# EAGLE design Joulev2_RealTime (EAGLE 8.2.0)

## Sheet 1 of 3
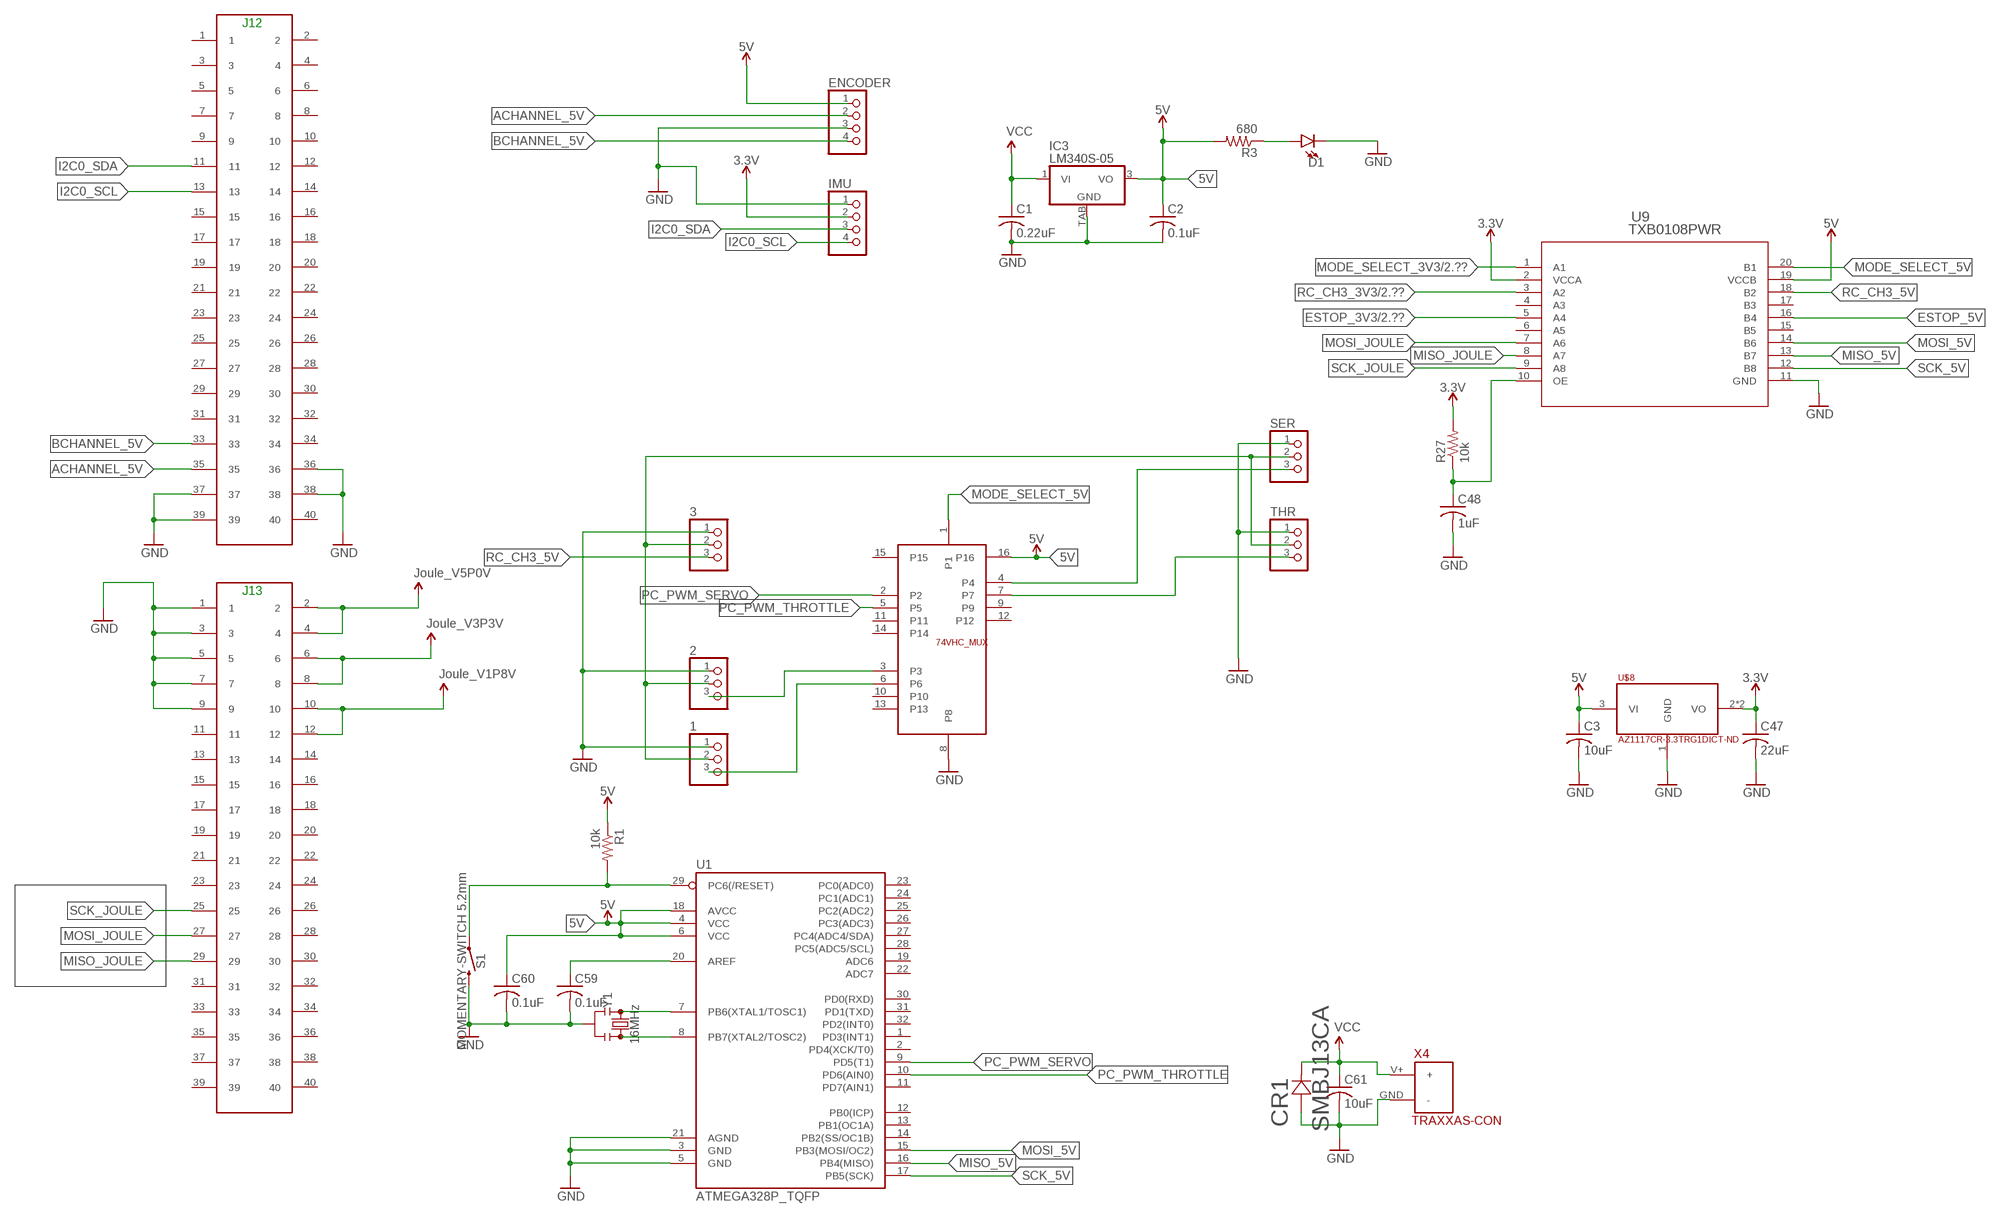
[diagram p0: schematic, sheet 1]

### Parts
1  PINHD-1X3  [1X03]
2  PINHD-1X3  [1X03]
3  PINHD-1X3  [1X03]
C1  0.22uF  C-USC0603  [C0603]
C2  0.1uF  C-USC0603  [C0603]
C3  10uF  C-USC0603  [C0603]
C47  22uF  C-USC0603  [C0603]
C48  1uF  C-USC0603  [C0603]
C59  0.1uF  C-USC0603  [C0603]
C60  0.1uF  C-USC0603  [C0603]
C61  10uF  C-USC0603  [C0603]
CR1  SMBJ13CA  [SMB]
D1  LED0603  [LED-0603]
ENCODER  PINHD-1X4  [1X04]
IC3  LM340S-05  [TO263-3]
IMU  PINHD-1X4  [1X04]
R1  10k  R-US_R0603  [R0603]
R3  680  R-US_R0603  [R0603]
R27  10k  R-US_R0603  [R0603]
S1  MOMENTARY-SWITCH 5.2mm  MOMENTARY-SWITCH-SPST-SMD-5.2MM  [TACTILE_SWITCH_SMD_5.2MM]
SER  PINHD-1X3  [1X03]
THR  PINHD-1X3  [1X03]
U1  ATMEGA328P_TQFP  [TQFP32-08]
U2  74VHC_MUXSO16  [SO16]
U9  TXB0108PWR  [PW20]
U$8  AZ1117CR-3.3TRG1DICT-ND  [SOT89R_INFINEON]
X1  J12HEADER_(JOULE)  [2X20]
X2  J13HEADER_(JOULE)  [2X20]
X4  TRAXXAS-CON  [TRAXXAS-CON]
Y1  16MHz  RESONATOR-16MHZSMD_3.2X1.3  [RESONATOR-SMD-3.2X1.3]

### Nets
3.3V: C47.1 IMU.2 R27.2 U9.2(VCCA) U$8.2(VO) U$8.4(VO) ; also sheet 2,3
5V: 1.2 2.2 3.2 C2.1 C3.1 C60.1 ENCODER.1 IC3.3(VO) R1.1 R3.2 SER.2 THR.2 U1.4(VCC) U1.6(VCC) U1.18(AVCC) U2.16 U9.19(VCCB) U$8.3(VI) ; also sheet 2,3
ACHANNEL_5V: ENCODER.2 X1.35
BCHANNEL_5V: ENCODER.4 X1.33
ESTOP_3V3: U9.5(A4) ; also sheet 2
ESTOP_5V: U9.16(B4) ; also sheet 2
GND: 1.1 2.1 3.1 C1.2 C2.2 C3.2 C47.2 C48.2 C59.2 C60.2 C61.2 CR1.2 D1.C ENCODER.3 IC3.TAB(GND) IMU.1 S1.3 SER.1 THR.1 U1.3(GND) U1.5(GND) U1.21(AGND) U2.8 U9.11(GND) U$8.1(GND) X1.36 X1.37 X1.38 X1.39 X2.1 X2.3 X2.5 X2.7 X2.9 X4.GND(-) Y1.2 ; also sheet 2,3
I2C0_SCL: IMU.4 X1.13
I2C0_SDA: IMU.3 X1.11
MISO_5V: U1.16(PB4(MISO)) U9.13(B7)
MISO_JOULE: U9.8(A7) X2.29
MODE_SELECT_3V3: U9.1(A1) ; also sheet 2
MODE_SELECT_5V: U2.1 U9.20(B1)
MOSI_5V: U1.15(PB3(MOSI/OC2)) U9.14(B6)
MOSI_JOULE: U9.7(A6) X2.27
N$2: SER.3 U2.4
N$3: THR.3 U2.7
N$4: R1.2 S1.1 U1.29(PC6(/RESET))
N$6: U1.7(PB6(XTAL1/TOSC1)) Y1.1
N$8: U1.8(PB7(XTAL2/TOSC2)) Y1.3
N$10: 2.3 U2.3
N$11: 1.3 U2.6
N$13: C59.1 U1.20(AREF)
N$20: D1.A R3.1
N$41: C48.1 R27.1 U9.10(OE)
PC_PWM_SERVO: U1.9(PD5(T1)) U2.2
PC_PWM_THROTTLE: U1.10(PD6(AIN0)) U2.5
RC_CH3_3V3: U9.3(A2) ; also sheet 2
RC_CH3_5V: 3.3 U9.18(B2)
SCK_5V: U1.17(PB5(SCK)) U9.12(B8)
SCK_JOULE: U9.9(A8) X2.25
V1P8V: X2.10 X2.12 ; supply symbol labelled Joule_V1P8V
V3P3V: X2.6 X2.8 ; supply symbol labelled Joule_V3P3V
V5P0V: X2.2 X2.4 ; supply symbol labelled Joule_V5P0V
VCC: C1.1 C61.1 CR1.1 IC3.1(VI) X4.V+(+) ; also sheet 2
Unconnected: U1.1(PD3(INT1)) U1.2(PD4(XCK/T0)) U1.11(PD7(AIN1)) U1.12(PB0(ICP)) U1.13(PB1(OC1A)) U1.14(PB2(SS/OC1B)) U1.19(ADC6) U1.22(ADC7) U1.23(PC0(ADC0)) U1.24(PC1(ADC1)) U1.25(PC2(ADC2)) U1.26(PC3(ADC3)) U1.27(PC4(ADC4/SDA)) U1.28(PC5(ADC5/SCL)) U1.30(PD0(RXD)) U1.31(PD1(TXD)) U1.32(PD2(INT0)) U2.9 U2.10 U2.11 U2.12 U2.13 U2.14 U2.15 U9.4(A3) U9.6(A5) U9.15(B5) U9.17(B3) X1.1 X1.2 X1.3 X1.4 X1.5 X1.6 X1.7 X1.8 X1.9 X1.10 X1.12 X1.14 X1.15 X1.16 X1.17 X1.18 X1.19 X1.20 X1.21 X1.22 X1.23 X1.24 X1.25 X1.26 X1.27 X1.28 X1.29 X1.30 X1.31 X1.32 X1.34 X1.40 X2.11 X2.13 X2.14 X2.15 X2.16 X2.17 X2.18 X2.19 X2.20 X2.21 X2.22 X2.23 X2.24 X2.26 X2.28 X2.30 X2.31 X2.32 X2.33 X2.34 X2.35 X2.36 X2.37 X2.38 X2.39 X2.40

### Notes on the sheet
- J12
- J13

## Sheet 2 of 3: E-stop
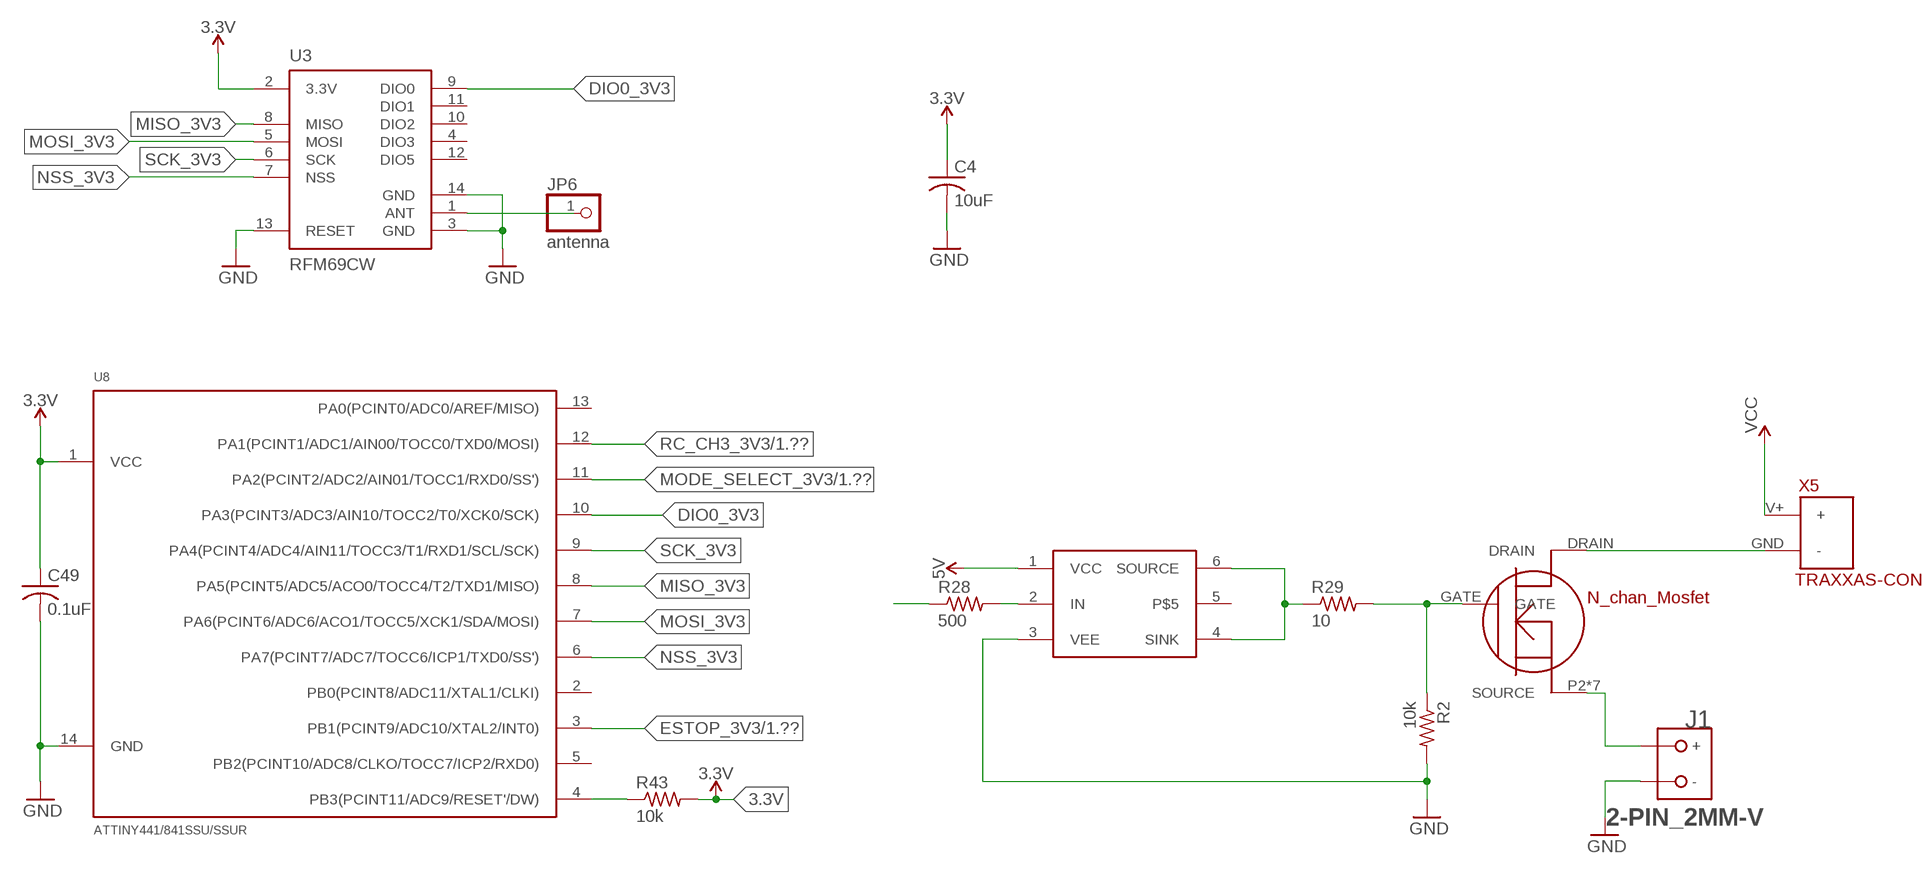
[diagram p1: schematic, sheet 2]

### Parts
C4  10uF  C-USC0603  [C0603]
C49  0.1uF  C-USC0603  [C0603]
J1  2-PIN_2MM-V  [2MM-2-V]
JP6  antenna  PINHD-1X1  [1X01]
Q1  N_CH_MOSFET_FDLBL260N100  [MO-299A]
R2  10k  R-US_R0603  [R0603]
R28  500  R-US_R0603  [R0603]
R29  10  R-US_R0603  [R0603]
R43  10k  R-US_R0603  [R0603]
U3  RFM69CW  [RFM69CW-XXXS2]
U8  ATTINY441/841SSU/SSUR  [SOIC-14]
U10  ZXGD3009DY  [SOT363]
X5  TRAXXAS-CON  [TRAXXAS-CON]

### Nets
3.3V: C4.1 C49.1 R43.2 U3.2(3.3V) U8.1(VCC) ; also sheet 1,3
5V: U10.1(VCC) ; also sheet 1,3
DIO0_3V3: U3.9(DIO0) U8.10(PA3(PCINT3/ADC3/AIN10/TOCC2/T0/XCK0/SCK))
ESTOP_3V3: U8.3(PB1(PCINT9/ADC10/XTAL2/INT0)) ; also sheet 1
ESTOP_5V: R28.1 ; also sheet 1
GND: C4.2 C49.2 J1.2(-) R2.2 U3.3(GND) U3.13(RESET) U3.14(GND) U8.14(GND) U10.3(VEE) ; also sheet 1,3
MISO_3V3: U3.8(MISO) U8.8(PA5(PCINT5/ADC5/ACO0/TOCC4/T2/TXD1/MISO))
MODE_SELECT_3V3: U8.11(PA2(PCINT2/ADC2/AIN01/TOCC1/RXD0/SS')) ; also sheet 1
MOSI_3V3: U3.5(MOSI) U8.7(PA6(PCINT6/ADC6/ACO1/TOCC5/XCK1/SDA/MOSI))
N$1: JP6.1 U3.1(ANT)
N$5: Q1.DRAIN X5.GND(-)
N$7: R28.2 U10.2(IN)
N$12: R43.1 U8.4(PB3(PCINT11/ADC9/RESET'/DW))
N$42: R29.1 U10.4(SINK) U10.6(SOURCE)
N$43: J1.1(+) Q1.P2(SOURCE) Q1.P3(SOURCE) Q1.P4(SOURCE) Q1.P5(SOURCE) Q1.P6(SOURCE) Q1.P7(SOURCE) Q1.P8(SOURCE)
N$45: Q1.GATE R2.1 R29.2
NSS_3V3: U3.7(NSS) U8.6(PA7(PCINT7/ADC7/TOCC6/ICP1/TXD0/SS'))
RC_CH3_3V3: U8.12(PA1(PCINT1/ADC1/AIN00/TOCC0/TXD0/MOSI)) ; also sheet 1
SCK_3V3: U3.6(SCK) U8.9(PA4(PCINT4/ADC4/AIN11/TOCC3/T1/RXD1/SCL/SCK))
VCC: X5.V+(+) ; also sheet 1
Unconnected: U3.4(DIO3) U3.10(DIO2) U3.11(DIO1) U3.12(DIO5) U8.2(PB0(PCINT8/ADC11/XTAL1/CLKI)) U8.5(PB2(PCINT10/ADC8/CLKO/TOCC7/ICP2/RXD0)) U8.13(PA0(PCINT0/ADC0/AREF/MISO)) U10.5

## Sheet 3 of 3: USB Hub
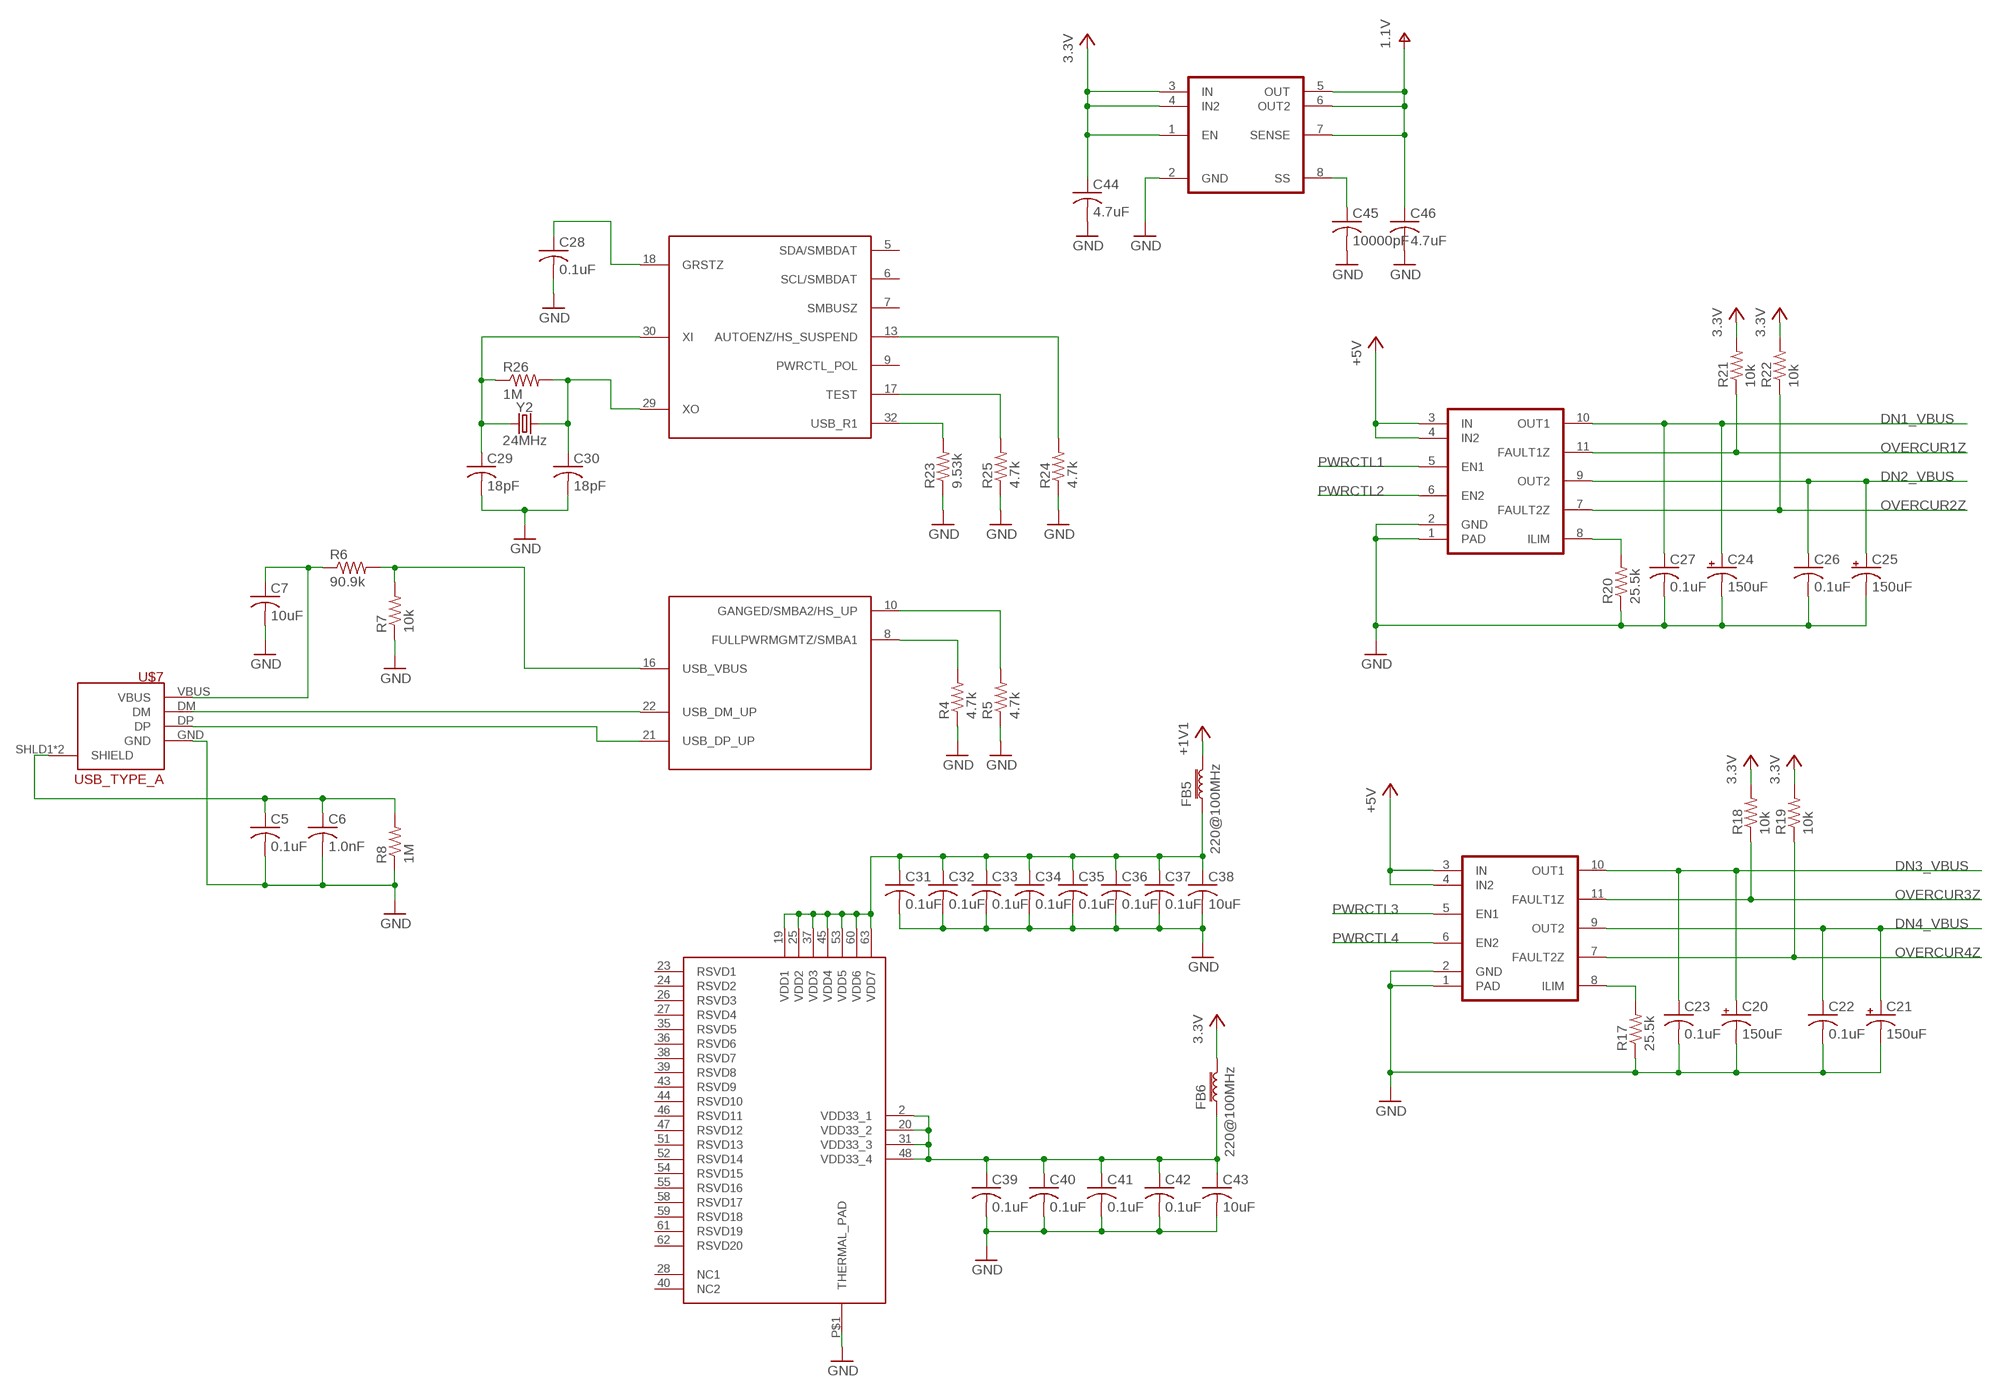
[diagram p2: schematic, sheet 3, part 1 of 2]
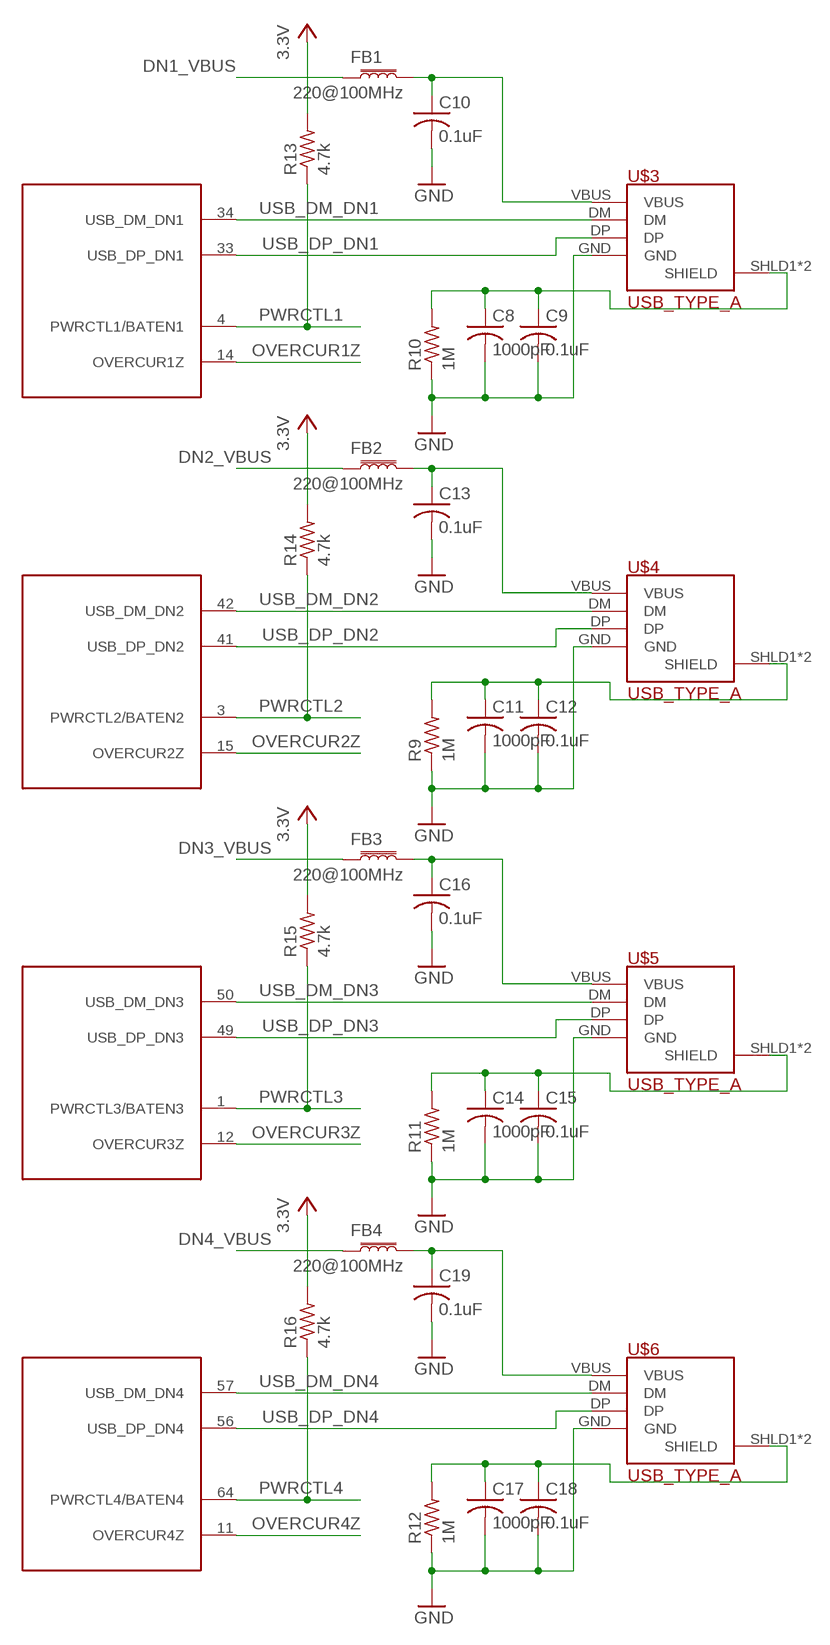
[diagram p3: schematic, sheet 3, part 2 of 2]

### Parts
C5  0.1uF  C-USC0603  [C0603]
C6  1.0nF  C-USC0603  [C0603]
C7  10uF  C-USC0603  [C0603]
C8  1000pF  C-USC0603  [C0603]
C9  0.1uF  C-USC0603  [C0603]
C10  0.1uF  C-USC0603  [C0603]
C11  1000pF  C-USC0603  [C0603]
C12  0.1uF  C-USC0603  [C0603]
C13  0.1uF  C-USC0603  [C0603]
C14  1000pF  C-USC0603  [C0603]
C15  0.1uF  C-USC0603  [C0603]
C16  0.1uF  C-USC0603  [C0603]
C17  1000pF  C-USC0603  [C0603]
C18  0.1uF  C-USC0603  [C0603]
C19  0.1uF  C-USC0603  [C0603]
C20  150uF  CPOL-USE3.5-8  [E3,5-8]
C21  150uF  CPOL-USE3.5-8  [E3,5-8]
C22  0.1uF  C-USC0603  [C0603]
C23  0.1uF  C-USC0603  [C0603]
C24  150uF  CPOL-USE3.5-8  [E3,5-8]
C25  150uF  CPOL-USE3.5-8  [E3,5-8]
C26  0.1uF  C-USC0603  [C0603]
C27  0.1uF  C-USC0603  [C0603]
C28  0.1uF  C-USC0603  [C0603]
C29  18pF  C-USC0603  [C0603]
C30  18pF  C-USC0603  [C0603]
C31  0.1uF  C-USC0603  [C0603]
C32  0.1uF  C-USC0603  [C0603]
C33  0.1uF  C-USC0603  [C0603]
C34  0.1uF  C-USC0603  [C0603]
C35  0.1uF  C-USC0603  [C0603]
C36  0.1uF  C-USC0603  [C0603]
C37  0.1uF  C-USC0603  [C0603]
C38  10uF  C-USC0603  [C0603]
C39  0.1uF  C-USC0603  [C0603]
C40  0.1uF  C-USC0603  [C0603]
C41  0.1uF  C-USC0603  [C0603]
C42  0.1uF  C-USC0603  [C0603]
C43  10uF  C-USC0603  [C0603]
C44  4.7uF  C-USC0603  [C0603]
C45  10000pF  C-USC0603  [C0603]
C46  4.7uF  C-USC0603  [C0603]
FB1  220@100MHz  FERRITE_BEAD-0603  [0603]
FB2  220@100MHz  FERRITE_BEAD-0603  [0603]
FB3  220@100MHz  FERRITE_BEAD-0603  [0603]
FB4  220@100MHz  FERRITE_BEAD-0603  [0603]
FB5  220@100MHz  FERRITE_BEAD-0603  [0603]
FB6  220@100MHz  FERRITE_BEAD-0603  [0603]
R4  4.7k  R-US_R0603  [R0603]
R5  4.7k  R-US_R0603  [R0603]
R6  90.9k  R-US_R0603  [R0603]
R7  10k  R-US_R0603  [R0603]
R8  1M  R-US_R0603  [R0603]
R9  1M  R-US_R0603  [R0603]
R10  1M  R-US_R0603  [R0603]
R11  1M  R-US_R0603  [R0603]
R12  1M  R-US_R0603  [R0603]
R13  4.7k  R-US_R0603  [R0603]
R14  4.7k  R-US_R0603  [R0603]
R15  4.7k  R-US_R0603  [R0603]
R16  4.7k  R-US_R0603  [R0603]
R17  25.5k  R-US_R0603  [R0603]
R18  10k  R-US_R0603  [R0603]
R19  10k  R-US_R0603  [R0603]
R20  25.5k  R-US_R0603  [R0603]
R21  10k  R-US_R0603  [R0603]
R22  10k  R-US_R0603  [R0603]
R23  9.53k  R-US_R0603  [R0603]
R24  4.7k  R-US_R0603  [R0603]
R25  4.7k  R-US_R0603  [R0603]
R26  1M  R-US_R0603  [R0603]
U4  ADP1706ARDZ-1.1-R7  [SOIC8]
U$1  TUSB4041  [TQFP64-10X10]
U$3  USB_TYPE_A  [USB_TYPE_A]
U$4  USB_TYPE_A  [USB_TYPE_A]
U$5  USB_TYPE_A  [USB_TYPE_A]
U$6  USB_TYPE_A  [USB_TYPE_A]
U$7  USB_TYPE_A  [USB_TYPE_A]
U$10  TPS2561DRCT  [10-VSON]
U$11  TPS2561DRCT  [10-VSON]
Y2  24MHz  CRYSTAL-24MHZ"  [CRYSTAL-SMD-5X3.2-4PAD]

### Nets
1.1V: C46.1 FB5.2 U4.5(OUT) U4.6(OUT2) U4.7(SENSE) ; supply symbol labelled +1V1
3.3V: C44.1 FB6.2 R13.2 R14.2 R15.2 R16.2 R18.2 R19.2 R21.2 R22.2 U4.1(EN) U4.3(IN) U4.4(IN2) ; also sheet 1,2
5V: U$10.3(IN) U$10.4(IN2) U$11.3(IN) U$11.4(IN2) ; supply symbol labelled +5V ; also sheet 1,2
DN1_VBUS: C24.+ C27.1 FB1.1 U$11.10(OUT1)
DN2_VBUS: C25.+ C26.1 FB2.1 U$11.9(OUT2)
DN3_VBUS: C20.+ C23.1 FB3.1 U$10.10(OUT1)
DN4_VBUS: C21.+ C22.1 FB4.1 U$10.9(OUT2)
GND: C5.2 C6.2 C7.2 C8.2 C9.2 C10.2 C11.2 C12.2 C13.2 C14.2 C15.2 C16.2 C17.2 C18.2 C19.2 C20.- C21.- C22.2 C23.2 C24.- C25.- C26.2 C27.2 C28.2 C29.2 C30.2 C31.2 C32.2 C33.2 C34.2 C35.2 C36.2 C37.2 C38.2 C39.2 C40.2 C41.2 C42.2 C43.2 C44.2 C45.2 C46.2 R4.1 R5.1 R7.1 R8.1 R9.1 R10.1 R11.1 R12.1 R17.1 R20.1 R23.1 R24.1 R25.1 U4.2(GND) U$1.P$1(THERMAL_PAD) U$3.GND U$4.GND U$5.GND U$6.GND U$7.GND U$10.1(PAD) U$10.2(GND) U$11.1(PAD) U$11.2(GND) ; also sheet 1,2
N$9: R4.2 U$1.8(FULLPWRMGMTZ/SMBA1)
N$14: R5.2 U$1.10(GANGED/SMBA2/HS_UP)
N$15: R6.2 R7.2 U$1.16(USB_VBUS)
N$16: C7.1 R6.1 U$7.VBUS
N$17: C13.1 FB2.2 U$4.VBUS
N$18: C5.1 C6.1 R8.2 U$7.SHLD1(SHIELD) U$7.SHLD2(SHIELD)
N$19: U$1.22(USB_DM_UP) U$7.DM
N$21: U$1.21(USB_DP_UP) U$7.DP
N$22: C16.1 FB3.2 U$5.VBUS
N$23: C10.1 FB1.2 U$3.VBUS
N$24: C19.1 FB4.2 U$6.VBUS
N$25: R20.2 U$11.8(ILIM)
N$26: C28.1 U$1.18(GRSTZ)
N$27: R23.2 U$1.32(USB_R1)
N$28: R17.2 U$10.8(ILIM)
N$29: C29.1 R26.1 U$1.30(XI) Y2.1
N$30: C30.1 R26.2 U$1.29(XO) Y2.3
N$31: R25.2 U$1.17(TEST)
N$32: C39.1 C40.1 C41.1 C42.1 C43.1 FB6.1 U$1.2(VDD33_1) U$1.20(VDD33_2) U$1.31(VDD33_3) U$1.48(VDD33_4)
N$33: R24.2 U$1.13(AUTOENZ/HS_SUSPEND)
N$34: C31.1 C32.1 C33.1 C34.1 C35.1 C36.1 C37.1 C38.1 FB5.1 U$1.19(VDD1) U$1.25(VDD2) U$1.37(VDD3) U$1.45(VDD4) U$1.53(VDD5) U$1.60(VDD6) U$1.63(VDD7)
N$35: C17.1 C18.1 R12.2 U$6.SHLD1(SHIELD) U$6.SHLD2(SHIELD)
N$36: C14.1 C15.1 R11.2 U$5.SHLD1(SHIELD) U$5.SHLD2(SHIELD)
N$37: C8.1 C9.1 R10.2 U$3.SHLD1(SHIELD) U$3.SHLD2(SHIELD)
N$38: C11.1 C12.1 R9.2 U$4.SHLD1(SHIELD) U$4.SHLD2(SHIELD)
N$40: C45.1 U4.8(SS)
OVERCUR1Z: R21.1 U$1.14(OVERCUR1Z) U$11.11(FAULT1Z)
OVERCUR2Z: R22.1 U$1.15(OVERCUR2Z) U$11.7(FAULT2Z)
OVERCUR3Z: R18.1 U$1.12(OVERCUR3Z) U$10.11(FAULT1Z)
OVERCUR4Z: R19.1 U$1.11(OVERCUR4Z) U$10.7(FAULT2Z)
PWRCTL1: R13.1 U$1.4(PWRCTL1/BATEN1) U$11.5(EN1)
PWRCTL2: R14.1 U$1.3(PWRCTL2/BATEN2) U$11.6(EN2)
PWRCTL3: R15.1 U$1.1(PWRCTL3/BATEN3) U$10.5(EN1)
PWRCTL4: R16.1 U$1.64(PWRCTL4/BATEN4) U$10.6(EN2)
USB_DM_DN1: U$1.34(USB_DM_DN1) U$3.DM
USB_DM_DN2: U$1.42(USB_DM_DN2) U$4.DM
USB_DM_DN3: U$1.50(USB_DM_DN3) U$5.DM
USB_DM_DN4: U$1.57(USB_DM_DN4) U$6.DM
USB_DP_DN1: U$1.33(USB_DP_DN1) U$3.DP
USB_DP_DN2: U$1.41(USB_DP_DN2) U$4.DP
USB_DP_DN3: U$1.49(USB_DP_DN3) U$5.DP
USB_DP_DN4: U$1.56(USB_DP_DN4) U$6.DP
Unconnected: U$1.5(SDA/SMBDAT) U$1.6(SCL/SMBDAT) U$1.7(SMBUSZ) U$1.9(PWRCTL_POL) U$1.23(RSVD1) U$1.24(RSVD2) U$1.26(RSVD3) U$1.27(RSVD4) U$1.28(NC1) U$1.35(RSVD5) U$1.36(RSVD6) U$1.38(RSVD7) U$1.39(RSVD8) U$1.40(NC2) U$1.43(RSVD9) U$1.44(RSVD10) U$1.46(RSVD11) U$1.47(RSVD12) U$1.51(RSVD13) U$1.52(RSVD14) U$1.54(RSVD15) U$1.55(RSVD16) U$1.58(RSVD17) U$1.59(RSVD18) U$1.61(RSVD19) U$1.62(RSVD20)

## Library data of the parts
1-3 SER THR = adafruit:PINHD-1X3: PIN HEADER
C1-C19 C22 C23 C26-C49 C59-C61 = rcl:C-US: CAPACITOR, American symbol
C20 C21 C24 C25 = rcl:CPOL-US: POLARIZED CAPACITOR, American symbol
CR1 = Roboracing:SMBJ13CA; MANUFACTURER_PART_NUMBER: SMBJ13CA; VENDOR: Bourns Electronics
D1 = SparkFun-LED:LED: LED (Generic) Standard schematic elements and footprints for 5mm, 3mm, 1206, and 0603 sized LEDs. Generic LEDs with no color specified.
ENCODER IMU = pinhead:PINHD-1X4: PIN HEADER
FB1-FB6 = SparkFun-Coils:FERRITE_BEAD: Ferrite Bead (blocks, cores, rings, chokes, etc.) Inductor with layers of ferrite used to suppress high frequencies. Often used to isolate high frequency noise. SparkFun Products: IOIO-OTG - V2.2 <https://www.sparkfun.com/products/13613> SparkFun SAMD21 Mini Breakout <https://www.sparkfun.com/products/13664> SparkFun 6 Degrees of Freedom Breakout - LSM6DS3 <https://www.sparkfun.com/products/13339> SparkFun SAMD21 Dev Breakout <https://www.sparkfun.com/products/13672>; PROD_ID: NDUC-07859; VALUE: 30Ω/1.8A
IC3 = linear:LM340?-*: Positive VOLTAGE REGULATOR Source: http://cache.national.com/ds/LM/LM340.pdf
J1 = RoboJackets-Connectors:2-PIN_2MM-*; PINS: 2; PIN_PITCH: 2.0 mm
JP6 = adafruit:PINHD-1X1: Pin header 1x1 for 0.1" spacing With round pins
Q1 = Roboracing:N_CH_MOSFET_FDLBL260N100
R1-R29 R43 = rcl:R-US_: RESISTOR, American symbol
S1 = Roboracing:MOMENTARY-SWITCH-SPST: Momentary Switch (Pushbutton) - SPST Normally-open (NO) SPST momentary switches (buttons, pushbuttons). Variants PTH-12MM - 12mm square, through-hole Momentary Pushbutton Switch - 12mm Square <https://www.sparkfun.com/products/9190> (COM-09190) PTH-6.0MM, PTH-6.0MM-KIT - 6.0mm square, through-hole Mini Pushbutton Switch <https://www.sparkfun.com/products/97> (COM-00097) KIT package intended for soldering kit's - only one side of pads' copper is exposed. PTH-RIGHT-ANGLE-KIT - Right-angle, through-hole Right Angle Tactile Button <https://www.sparkfun.com/products/10791> - Used on SparkFun BigTime Watch Kit <https://www.sparkfun.com/products/11734> SMD-12MM - 12mm square, surface-mount Tactile Button - SMD (12mm) <https://www.sparkfun.com/products/12993> (COM-12993) Used on SparkFun PicoBoard <https://www.sparkfun.com/products/11888> SMD-4.5MM - 4.5mm Square Trackball Switch Used on SparkFun Blackberry Trackballer Breakout <https://www.sparkfun.com/products/13169> SMD-4.6MMX2.8MM - 4.60mm x 2.80mm, surface mount Used on SparkFun SAMD21 Mini Breakout <https://www.sparkfun.com/products/13664> SMD-5.2MM, SMD-5.2-REDUNDANT - 5.2mm square, surface-mount Mini Pushbutton Switch - SMD <https://www.sparkfun.com/products/8720> (COM-08720) Used on Arduino Pro Mini <https://www.sparkfun.com/products/11114> REDUNDANT package connects both switch circuits together SMD-6.0X3.5MM - 6.0 x 3.5mm, surface mount Momentary Reset Switch SMD <https://www.sparkfun.com/products/8229> (COM-08229) SMD-6.2MM-TALL - 6.2mm square, surface mount Tactile Button - SMD (6mm) <https://www.sparkfun.com/products/12992> Used on SparkFun Digital Sandbox <https://www.sparkfun.com/products/12651> SMD-RIGHT-ANGLE - Right-angle, surface mount Used on SparkFun Block for Intel® Edison - Arduino <https://www.sparkfun.com/products/13036>; PROD_ID: SWCH-08247; SF_SKU: COM-08720
U1 = SparkFun-IC-Microcontroller:ATMEGA328P_TQFP: Popular 328P in QFP Storefront component: ATmega328 - TQFP <https://www.sparkfun.com/products/13448> (COM-13448) Datasheet <http://www.sparkfun.com/datasheets/Components/SMD/ATMega328.pdf> SparkFun Products SparkFun RedBoard - Programmed with Arduino <https://www.sparkfun.com/products/12757> (DEV-12757) Arduino Pro Mini 328 - 5V/16MHz <https://www.sparkfun.com/products/11113> (DEV-11113) Arduino Pro Mini 328 - 3.3V/8MHz <https://www.sparkfun.com/products/11114> (DEV-11114) SparkFun OpenLog <https://www.sparkfun.com/products/13712> (DEV-13712) SparkFun MicroView - OLED Arduino Module <https://www.sparkfun.com/products/12923> (DEV-12923) SparkFun Digital Sandbox <https://www.sparkfun.com/products/12651> (DEV-12651) SparkFun PicoBoard <https://www.sparkfun.com/products/11888> (WIG-11888) Arduino Fio <https://www.sparkfun.com/products/10116> (DEV-10116) LilyPad Arduino 328 Main Board <https://www.sparkfun.com/products/13342> (DEV-13342) SparkFun RedStick <https://www.sparkfun.com/products/13741> (DEV-13741) LilyPad MP3 <https://www.sparkfun.com/products/11013> (DEV-11013) LilyPad Arduino SimpleSnap <https://www.sparkfun.com/products/10941> (DEV-10941) SparkFun Stepoko <https://www.sparkfun.com/products/13899> (ROB-13899) SparkFun Geiger Counter <https://www.sparkfun.com/products/11345> (SEN-11345) SparkFun EL Sequencer <https://www.sparkfun.com/products/12781> (COM-12781) Arduino Pro 328 - 5V/16MHz <https://www.sparkfun.com/products/10915> (DEV-10915) CryptoCape <https://www.sparkfun.com/products/12773> (DEV-12773) SparkFun IR Thermometer Evaluation Board - MLX90614 <https://www.sparkfun.com/products/10740> (SEN-10740) SparkFun RedBot Mainboard <https://www.sparkfun.com/products/12097> (ROB-12097) Arduino Pro 328 - 3.3V/8MHz <https://www.sparkfun.com/products/10914> (DEV-10914) SparkFun Block for Intel® Edison - Arduino <https://www.sparkfun.com/products/13036> (DEV-13036) SparkFun Simon Says - Surface Mount Soldering Kit <https://www.sparkfun.com/products/10935> (KIT-10935) SparkFun 7-Segment Serial Display - Red <https://www.sparkfun.com/products/11441> (COM-11441) SparkFun 7-Segment Serial Display - White <https://www.sparkfun.com/products/11629> (COM-11629) SparkFun 7-Segment Serial Display - Yellow <https://www.sparkfun.com/products/11443> (COM-11443) SparkFun 7-Segment Serial Display - Kelly Green <https://www.sparkfun.com/products/11440> (COM-11440) SparkFun 7-Segment Serial Display - Blue <https://www.sparkfun.com/products/11442> (COM-11442) SparkFun OpenSegment Serial Display - 20mm (Blue) <https://www.sparkfun.com/products/11647> (COM-11647) SparkFun OpenSegment Serial Display - 20mm (Green) <https://www.sparkfun.com/products/11646> (COM-11646) SparkFun OpenSegment Serial Display - 20mm (White) <https://www.sparkfun.com/products/11648> (COM-11648) SparkFun OpenSegment Serial Display - 20mm (Red) <https://www.sparkfun.com/products/11644> (COM-11644) SparkFun OpenSegment Serial Display - 20mm (Yellow) <https://www.sparkfun.com/products/11645> (COM-11645) SparkFun OpenSegment Shield <https://www.sparkfun.com/products/13190> (DEV-13190); PROD_ID: IC-09069
U2 = Roboracing:74VHC_MUX
U3 = mike-temp:RFM69
U4 = Roboracing:ADP1706ARDZ-1.1-R7
U8 = rgb-led:ATTINY441/841
U9 = Roboracing:TXB0108PWR; MANUFACTURER_PART_NUMBER: TXB0108PWR; VENDOR: Texas Instruments
U10 = Roboracing:ZXGD3009DY
U$1 = Roboracing:TUSB4041
U$3-U$7 = Roboracing:USB_TYPE_A
U$8 = Roboracing:AZ1117CR-3.3TRG1DICT-ND
U$10 U$11 = Roboracing:TPS2561DRCT
X1 = Roboracing:J12HEADER_(JOULE)
X2 = Roboracing:J13HEADER_(JOULE)
X4 X5 = Roboracing:TRAXXAS-CON
Y1 = SparkFun-Clocks:RESONATOR-16MHZ: 16MHz Resonator Digikey Example <http://www.digikey.com/product-detail/en/murata-electronics-north-america/CSTCE16M0V53-R0/490-1198-1-ND/584635> Frequency: 16MHz Frequency Stability: ±0.3% Frequency Tolerance: ±0.5% Capacitance: 15pF SparkFun Products SparkFun OpenLog <https://www.sparkfun.com/products/13712> SparkFun MicroView - OLED Arduino Module <https://www.sparkfun.com/products/12923>; PROD_ID: XTAL-08900
Y2 = SparkFun-Clocks:CRYSTAL-24MHZ: 24MHz Crystal Datasheet <http://www.sparkfun.com/datasheets/Components/AT-SMD-5x3.pdf> Frequency: 24MHz Frequency Tolerance: ±20ppm Load Capacitance: 12pF SparkFun Products: USB Bit Whacker <https://www.sparkfun.com/products/762>; PROD_ID: XTAL-08298; SF_ID: COM-08581

## Board
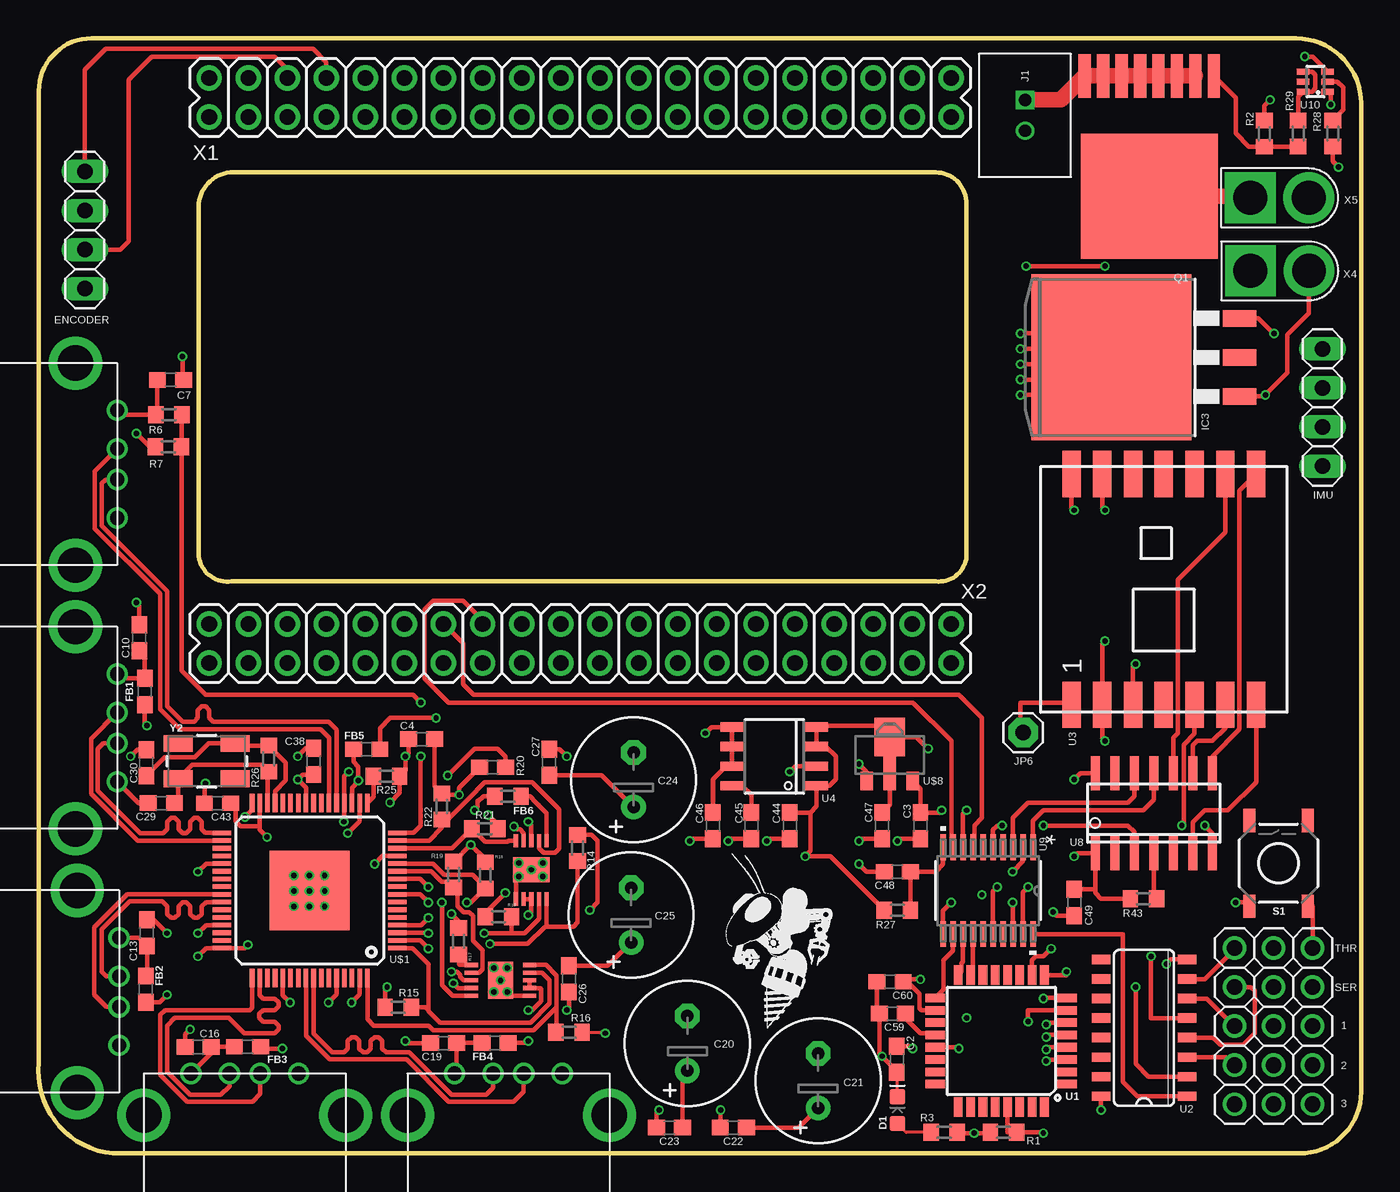
[diagram p4: board, top side]
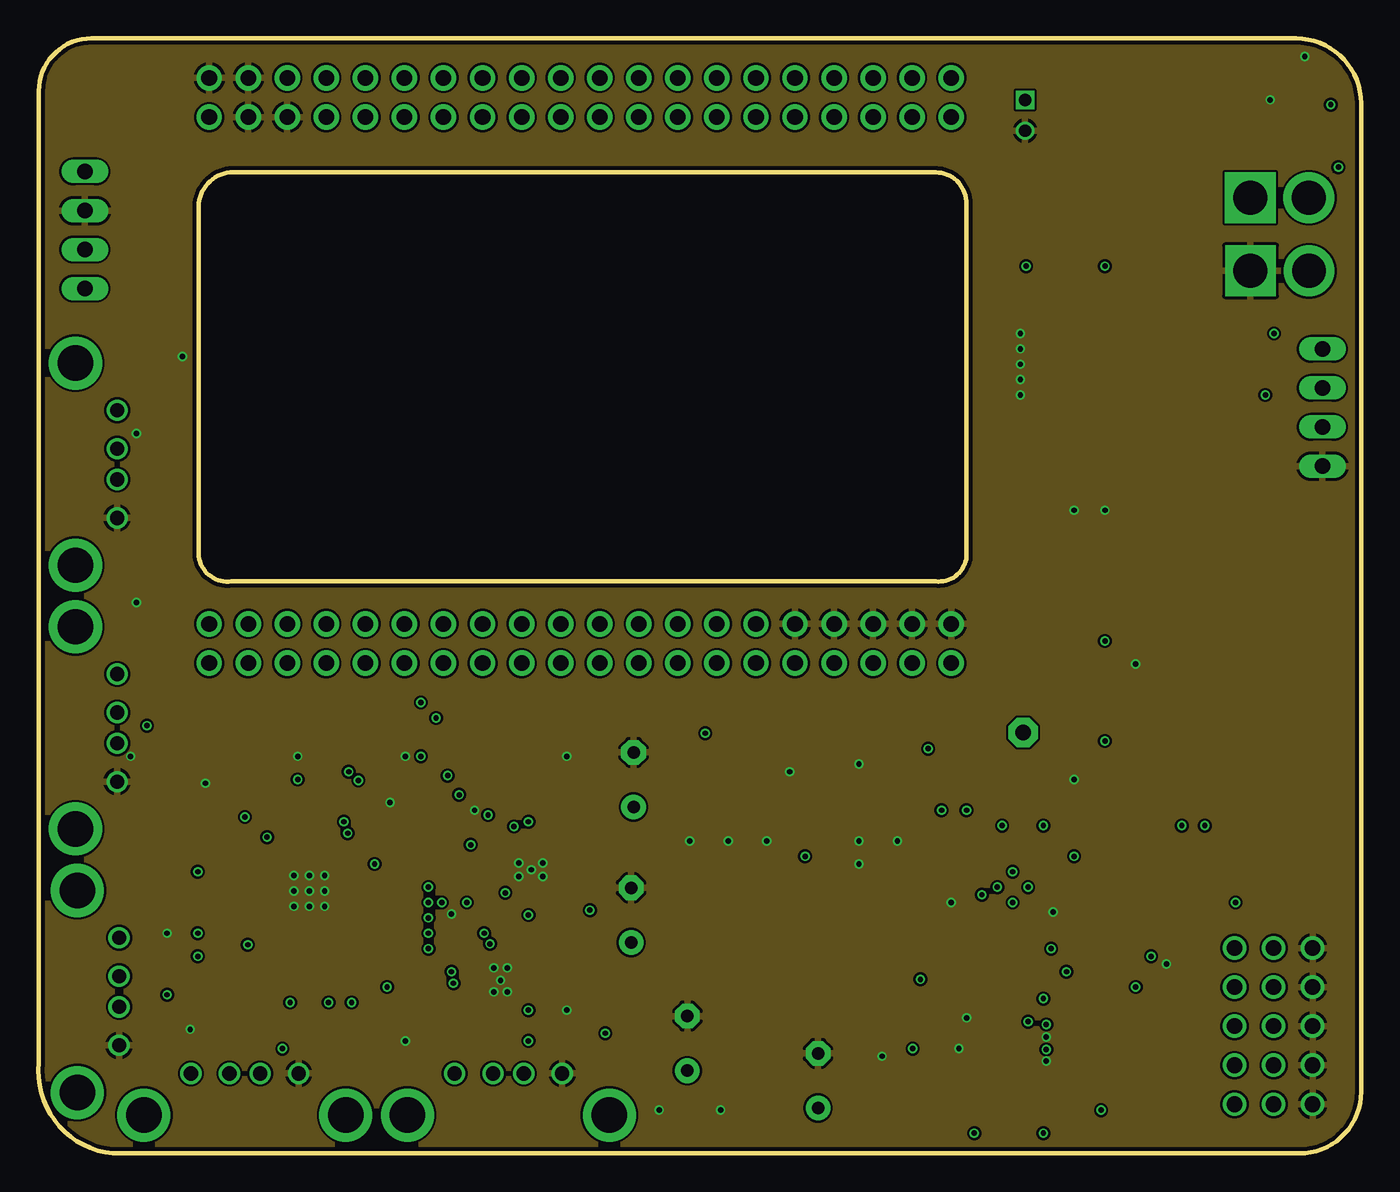
[diagram p5: board, inner layer Route2]
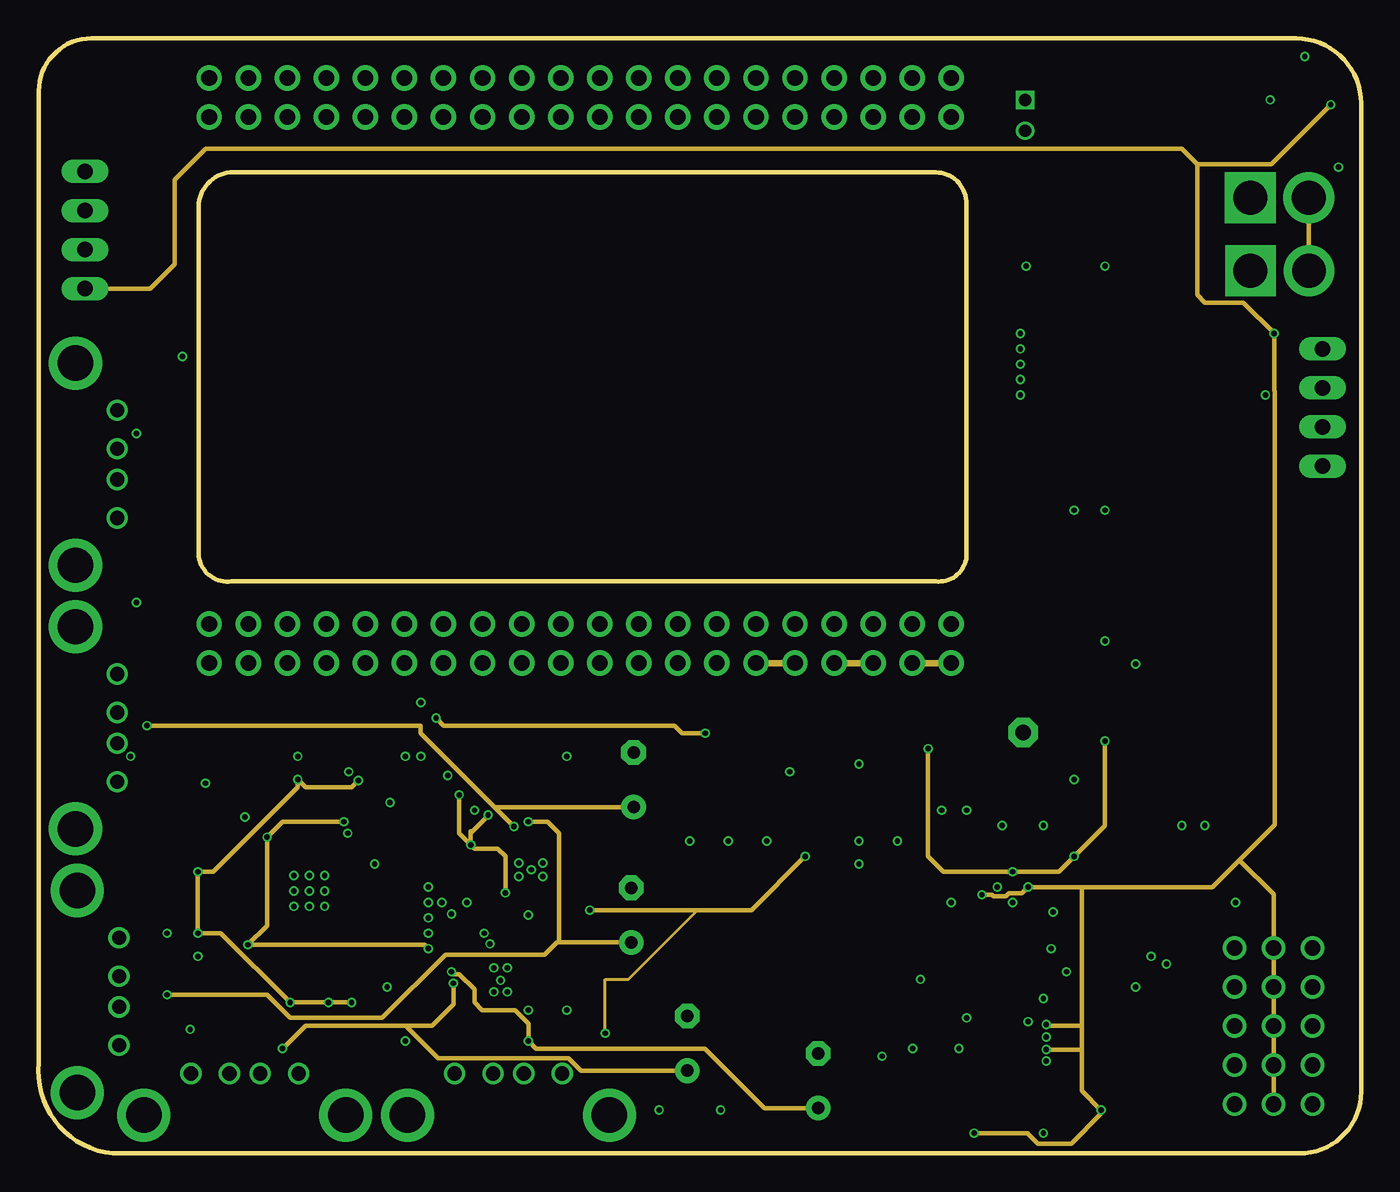
[diagram p6: board, inner layer Route3]
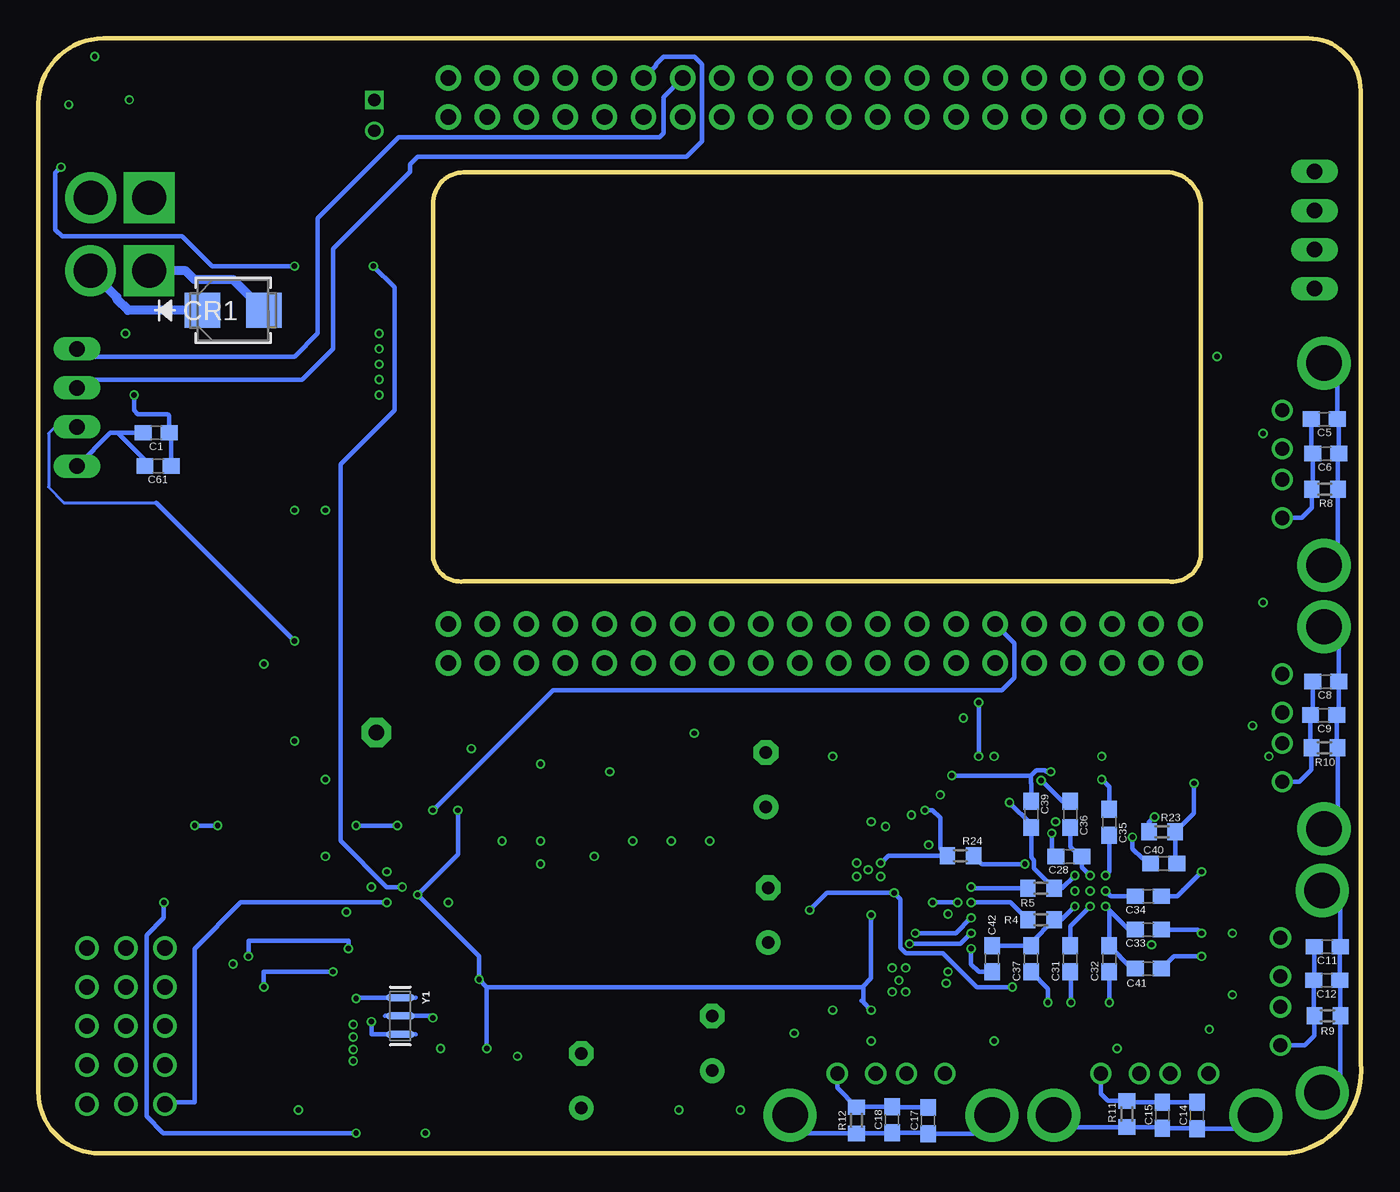
[diagram p7: board, bottom side, seen from below]

Size 86.03 x 72.5 mm. Coordinates in mm from the lower left corner, seen from the top.
Outline: 86.03,4 86.03,68.27 arc90 81.8,72.5 3.44,72.5 arc90 0.03,69.09 0.03,5.91 arc90 4.83,0 82.03,0 arc90 86.03,4
Outline: 58.37,63.79 12.67,63.79 arc90 10.43,61.55 10.43,38.82 arc90 12.54,37.2 58.37,37.2 arc90 60.37,38.82 60.37,61.73 arc90 58.37,63.79
Copper layers (1+2*3+16): Top 0.018mm / dielectric 0.36mm / Route2 0.035mm / dielectric 0.71mm / Route3 0.035mm / dielectric 0.36mm / Bottom 0.018mm
Design rules "eC_4Layer_PClass6_BaseCopperO18-I35_eCDefault *": minimum track width 0.15mm, minimum drill 0.35mm, track to track 0.15mm, track to pad 0.15mm, pad to pad 0.15mm, via to via 0.15mm, smd to smd 0mil, copper to edge 0.25mm, drill to drill 0.35mm, minimum pad ring 0.175mm, minimum via ring 0.125mm, stop-mask expansion 0mil, vias tented up to drill 0.45mm, thermal gap 0.2mm

### Footprints (pad centres in the part's own frame; a part is rotated, then mirrored left to right if it is on the bottom)
1X03 = drill 1.016: 1 -2.54,0; 2 0,0; 3 2.54,0
C0603 = smd 1.1 x 1: 1 -0.85,0; 2 0.85,0
E3,5-8 = drill 0.813 pad 1.6: + -1.778,0 | drill 0.813 pad 1.6 octagon: - 1.778,0
SMB = smd 2.311 x 2.261: 1 -1.994,0; 2 1.994,0
LED-0603 = smd 1 x 1: A -0.877,0; C 0.877,0
1X04 = drill 1.016 long: 1 -3.81,0; 2 -1.27,0; 3 1.27,0; 4 3.81,0
0603 = smd 1.1 x 1: 1 -0.85,0; 2 0.85,0
TO263-3 = smd 1.067 x 2.159: 1 -2.54,-5.791; 2 0,-5.791; 3 2.54,-5.791 | smd 10.8 x 10.41: TAB 0,2.54
2MM-2-V = drill 0.8 square: 1 0,0 | drill 0.8: 2 2,0
1X01 = drill 1.016 pad 1.93 octagon: 1 0,0
MO-299A = smd 8.9 x 8.1: DRAIN 0,2.58 | smd 0.8 x 2.8: GATE -4.2,-5.24; P2 -3,-5.24; P3 -1.8,-5.24; P4 -0.6,-5.24; P5 0.6,-5.24; P6 1.8,-5.24; P7 3,-5.24; P8 4.2,-5.24
R0603 = smd 1 x 1.1: 1 -0.85,0; 2 0.85,0
TACTILE_SWITCH_SMD_5.2MM = smd 1.524 x 0.762: 1 -2.794,1.905; 2 2.794,1.905; 3 -2.794,-1.905; 4 2.794,-1.905
TQFP32-08 = smd 1.27 x 0.559: 1 -4.293,2.8; 2 -4.293,2; 3 -4.293,1.2; 4 -4.293,0.4; 5 -4.293,-0.4; 6 -4.293,-1.2; 7 -4.293,-2; 8 -4.293,-2.8; 17 4.293,-2.8; 18 4.293,-2; 19 4.293,-1.2; 20 4.293,-0.4; 21 4.293,0.4; 22 4.293,1.2; 23 4.293,2; 24 4.293,2.8 | smd 0.559 x 1.27: 9 -2.8,-4.293; 10 -2,-4.293; 11 -1.2,-4.293; 12 -0.4,-4.293; 13 0.4,-4.293; 14 1.2,-4.293; 15 2,-4.293; 16 2.8,-4.293; 25 2.8,4.293; 26 2,4.293; 27 1.2,4.293; 28 0.4,4.293; 29 -0.4,4.293; 30 -1.2,4.293; 31 -2,4.293; 32 -2.8,4.293
SO16 = smd 0.6 x 1.2: 1 -4.445,-2.8; 2 -3.175,-2.8; 3 -1.905,-2.8; 4 -0.635,-2.8; 5 0.635,-2.8; 6 1.905,-2.8; 7 3.175,-2.8; 8 4.445,-2.8; 9 4.445,2.8; 10 3.175,2.8; 11 1.905,2.8; 12 0.635,2.8; 13 -0.635,2.8; 14 -1.905,2.8; 15 -3.175,2.8; 16 -4.445,2.8
RFM69CW-XXXS2 = smd 3 x 1.2: 1 -7.5,6; 2 -7.5,4; 3 -7.5,2; 4 -7.5,0; 5 -7.5,-2; 6 -7.5,-4; 7 -7.5,-6; 8 7.5,-6; 9 7.5,-4; 10 7.5,-2; 11 7.5,0; 12 7.5,2; 13 7.5,4; 14 7.5,6
SOIC8 = smd 0.6 x 1.5: 1 -1.905,-2.75; 2 -0.635,-2.75; 3 0.635,-2.75; 4 1.905,-2.75; 5 1.905,2.75; 6 0.635,2.75; 7 -0.635,2.75; 8 -1.905,2.75
SOIC-14 = smd 0.6 x 2.2: 1 -3.81,-2.6; 2 -2.54,-2.6; 3 -1.27,-2.6; 4 0,-2.6; 5 1.27,-2.6; 6 2.54,-2.6; 7 3.81,-2.6; 8 3.81,2.6; 9 2.54,2.6; 10 1.27,2.6; 11 0,2.6; 12 -1.27,2.6; 13 -2.54,2.6; 14 -3.81,2.6
PW20 = smd 1.676 x 0.356: 1 -2.819,2.925; 2 -2.819,2.275; 3 -2.819,1.625; 4 -2.819,0.975; 5 -2.819,0.325; 6 -2.819,-0.325; 7 -2.819,-0.975; 8 -2.819,-1.625; 9 -2.819,-2.275; 10 -2.819,-2.925; 11 2.819,-2.925; 12 2.819,-2.275; 13 2.819,-1.625; 14 2.819,-0.975; 15 2.819,-0.325; 16 2.819,0.325; 17 2.819,0.975; 18 2.819,1.625; 19 2.819,2.275; 20 2.819,2.925
SOT363 = smd 0.4 x 0.8: 1 -0.65,-0.8; 2 0,-0.8; 3 0.65,-0.8; 4 0.65,0.8; 5 0,0.8; 6 -0.65,0.8
TQFP64-10X10 = smd 1.2 x 0.3: 1 -5.7,3.75; 2 -5.7,3.25; 3 -5.7,2.75; 4 -5.7,2.25; 5 -5.7,1.75; 6 -5.7,1.25; 7 -5.7,0.75; 8 -5.7,0.25; 9 -5.7,-0.25; 10 -5.7,-0.75; 11 -5.7,-1.25; 12 -5.7,-1.75; 13 -5.7,-2.25; 14 -5.7,-2.75; 15 -5.7,-3.25; 16 -5.7,-3.75; 33 5.7,-3.75; 34 5.7,-3.25; 35 5.7,-2.75; 36 5.7,-2.25; 37 5.7,-1.75; 38 5.7,-1.25; 39 5.7,-0.75; 40 5.7,-0.25; 41 5.7,0.25; 42 5.7,0.75; 43 5.7,1.25; 44 5.7,1.75; 45 5.7,2.25; 46 5.7,2.75; 47 5.7,3.25; 48 5.7,3.75 | smd 0.3 x 1.2: 17 -3.75,-5.7; 18 -3.25,-5.7; 19 -2.75,-5.7; 20 -2.25,-5.7; 21 -1.75,-5.7; 22 -1.25,-5.7; 23 -0.75,-5.7; 24 -0.25,-5.7; 25 0.25,-5.7; 26 0.75,-5.7; 27 1.25,-5.7; 28 1.75,-5.7; 29 2.25,-5.7; 30 2.75,-5.7; 31 3.25,-5.7; 32 3.75,-5.7; 49 3.75,5.7; 50 3.25,5.7; 51 2.75,5.7; 52 2.25,5.7; 53 1.75,5.7; 54 1.25,5.7; 55 0.75,5.7; 56 0.25,5.7; 57 -0.25,5.7; 58 -0.75,5.7; 59 -1.25,5.7; 60 -1.75,5.7; 61 -2.25,5.7; 62 -2.75,5.7; 63 -3.25,5.7; 64 -3.75,5.7 | smd 5.19 x 5.19: P$1 0,0
USB_TYPE_A = drill 0.92: DM 5.57,2.71; DP 7.57,2.71; GND 10.07,2.71; VBUS 3.07,2.71 | drill 2.3: SHLD1 13.14,0; SHLD2 0,0
SOT89R_INFINEON = smd 0.8 x 1.2: 1 -1.5,-1.6; 3 1.5,-1.6 | smd 0.8 x 2.3: 2 0,-1.05 | smd 2 x 2.5: 4 0,1.25
10-VSON = smd 2.4 x 1.65: 1 0,0 | smd 0.28 x 0.85: 2 1,1.9; 3 0.5,1.9; 4 0,1.9; 5 -0.5,1.9; 6 -1,1.9; 7 -0.5,-1.9; 8 -1,-1.9; 9 0,-1.9; 10 0.5,-1.9; 11 1,-1.9
2X20 = drill 1.016 pad 1.651: 1 -24.13,-1.27; 2 -24.13,1.27; 3 -21.59,-1.27; 4 -21.59,1.27; 5 -19.05,-1.27; 6 -19.05,1.27; 7 -16.51,-1.27; 8 -16.51,1.27; 9 -13.97,-1.27; 10 -13.97,1.27; 11 -11.43,-1.27; 12 -11.43,1.27; 13 -8.89,-1.27; 14 -8.89,1.27; 15 -6.35,-1.27; 16 -6.35,1.27; 17 -3.81,-1.27; 18 -3.81,1.27; 19 -1.27,-1.27; 20 -1.27,1.27; 21 1.27,-1.27; 22 1.27,1.27; 23 3.81,-1.27; 24 3.81,1.27; 25 6.35,-1.27; 26 6.35,1.27; 27 8.89,-1.27; 28 8.89,1.27; 29 11.43,-1.27; 30 11.43,1.27; 31 13.97,-1.27; 32 13.97,1.27; 33 16.51,-1.27; 34 16.51,1.27; 35 19.05,-1.27; 36 19.05,1.27; 37 21.59,-1.27; 38 21.59,1.27; 39 24.13,-1.27; 40 24.13,1.27
TRAXXAS-CON = drill 2.2 square: GND -1.905,0 | drill 2.2: V+ 1.905,0
RESONATOR-SMD-3.2X1.3 = smd 0.45 x 1.905: 1 -1.2,0; 2 0,0; 3 1.2,0
CRYSTAL-SMD-5X3.2-4PAD = smd 1.9 x 1.1: 1 -1.85,-1.15; 2 1.85,-1.15; 3 1.85,1.15; 4 -1.85,1.15

### Placement (x,y rotation side)
1  80.34,8.28 180 top
2  80.34,5.74 180 top
3  80.34,3.2 180 top
C1  78.37,46.86 180 bottom
C2  55.83,6.13 270 top
C3  57.37,21.32 270 top
C4  24.92,26.95 180 top
C5  2.39,47.76 180 bottom
C6  2.29,45.51 180 bottom
C7  8.59,50.29 0 top
C8  2.29,30.69 180 bottom
C9  2.44,28.51 180 bottom
C10  6.56,33.54 90 top
C11  2.2,13.44 180 bottom
C12  2.24,11.26 180 bottom
C13  7.06,14.34 90 top
C14  10.67,2.47 90 bottom
C15  12.93,2.49 90 bottom
C16  10.4,6.93 180 top
C17  28.17,2.14 90 bottom
C18  30.51,2.19 90 bottom
C19  26.35,7.18 180 top
C20  42.21,7.16 90 top
C21  50.71,4.73 90 top
C22  45.2,1.68 180 top
C23  41.05,1.68 180 top
C24  38.71,24.3 90 top
C25  38.55,15.5 90 top
C26  34.51,11.35 270 top
C27  33.23,25.44 90 top
C28  19.01,19.3 0 bottom
C29  8,22.79 180 top
C30  7.02,25.4 90 top
C31  18.92,12.66 90 bottom
C32  16.38,12.66 90 bottom
C33  13.84,14.56 180 bottom
C34  13.84,16.73 180 bottom
C35  16.38,21.55 270 bottom
C36  18.92,22.05 270 bottom
C37  21.46,12.66 90 bottom
C38  17.9,25.49 90 top
C39  21.46,22.05 270 bottom
C40  12.84,18.85 0 bottom
C41  13.84,12.02 180 bottom
C42  24,12.66 90 bottom
C43  11.65,22.77 180 top
C44  48.87,21.32 270 top
C45  46.37,21.32 270 top
C46  43.87,21.32 270 top
C47  54.87,21.32 270 top
C48  55.87,18.32 180 top
C49  67.37,16.32 270 top
C59  55.55,9.1 180 top
C60  55.4,11.16 180 top
C61  78.25,44.71 180 bottom
CR1  73.37,54.82 0 bottom
D1  55.87,2.82 90 top
ENCODER  3.02,60.04 90 top
FB1  6.93,30.04 90 top
FB2  6.99,10.69 90 top
FB3  13.6,6.94 180 top
FB4  29.7,7.19 180 top
FB5  21.36,26.28 0 top
FB6  29.54,25.11 180 top
IC3  72.34,51.76 90 top
IMU  83.52,48.51 90 top
J1  64.17,68.5 270 top
JP6  64.05,27.37 0 top
Q1  72.25,64.82 180 top
R1  62.77,1.38 0 top
R2  79.74,66.31 90 top
R3  58.91,1.38 0 top
R4  20.82,15.2 180 bottom
R5  20.82,17.23 180 bottom
R6  8.49,48.04 0 top
R7  8.46,45.95 0 top
R8  2.36,43.2 0 bottom
R9  2.19,8.95 0 bottom
R10  2.38,26.37 0 bottom
R11  15.24,2.57 270 bottom
R12  32.82,2.16 270 bottom
R13  29.93,15.39 180 top
R14  35.07,19.87 90 top
R15  23.4,9.52 180 top
R16  34.51,7.87 0 top
R17  27.34,13.8 270 top
R18  29.07,18.09 90 top
R19  27.01,18.13 90 top
R20  30.54,23.23 0 top
R21  29.04,21.12 0 top
R22  26.24,22.56 90 top
R23  12.94,20.91 180 bottom
R24  26.06,19.37 0 bottom
R25  22.64,24.52 180 top
R26  14.99,25.67 90 top
R27  55.87,15.82 180 top
R28  84.18,66.32 90 top
R29  81.93,66.32 270 top
R43  71.87,16.57 180 top
S1  80.66,18.87 90 top
SER  80.34,10.82 180 top
THR  80.34,13.36 180 top
U1  62.63,7.31 180 top
U2  71.91,8.17 90 top
U3  73.2,36.68 90 top
U4  47.87,25.82 90 top
U8  72.55,22.13 0 top
U9  61.77,17.09 270 top
U10  83.06,69.69 90 top
U$1  17.65,17.1 180 top
U$3  2.41,34.24 270 top
U$4  2.53,17.1 270 top
U$5  6.85,2.49 0 top
U$6  24,2.49 0 top
U$7  2.41,51.39 270 top
U$8  55.37,25.82 0 top
U$9  [ROBOBUZZ_0.6X]  47.37,8.13 0 top
U$10  30.06,11.26 270 top
U$11  32.06,18.45 180 top
X1  35.24,68.66 180 top
X2  35.24,33.16 180 top
X4  80.74,57.39 0 top
X5  80.73,62.14 0 top
Y1  62.49,8.94 90 bottom
Y2  10.95,25.51 0 top

### Tracks (layer width: path | path; a pad name or v marks a point on that pad's centre or on a via)
1.1V  (via drill 0.35)
  Top 0.3: C46.1 43.87,24.32 44.73,25.18 U4.7 U4.6 U4.5 43.77,27.73 v43.37,27.32 | v25.87,28.32 22.87,28.32 22.21,27.66 FB5.2
  Route3 0.3: v43.37,27.32 41.87,27.32 41.37,27.82 26.37,27.82 v25.87,28.32
3.3V  (via drill 0.35)
  Top 0.2: R16.2 36.82,7.87 v36.87,7.82 | 69.2,33.15 v69.37,33.32
  Top 0.3: R18.2 29.07,19.12 v28.12,20.07 27.03,18.98 R19.2 | 68.74,17.32 68.74,16.95 69.12,16.57 R43.2 | 68.74,17.32 U8.1 67.58,19.53 v67.37,19.32 | 29.24,21.95 v29.24,22.01 29.89,21.36 R21.2 | C4.1 25.77,23.88 R22.2 26.33,23.32 v27.37,23.32 27.37,23.79 FB6.2 | C47.1 55.37,22.67 U$8.2 U$8.4 | C44.1 50.22,22.17 | 50.22,22.17 50.62,22.57 U4.1 51.46,23.91 51.87,24.32 51.87,25.82 51.23,26.46 U4.3 U4.4 50.71,27.82 55.37,27.82 U$8.4 | 50.22,22.17 50.22,19.67 v49.87,19.32 51.52,19.32 R27.2 | U9.2 64.04,19 v63.37,18.32 | U$8.4 57.12,27.07 v57.87,26.32 | C49.1 68.59,17.17 68.74,17.32 | 69.2,33.15 U3.2 69.2,26.99 v69.37,26.82 | 29.08,15.59 R13.2 29.08,15.65 v30.37,16.95 | R15.2 22.55,10.69 v22.68,10.82 | R14.2 35.97,20.72 36.37,20.32 36.37,16.32 v35.87,15.82
  Route3 0.2: v36.87,7.82 36.87,11.32 38.37,11.32 42.87,15.82
  Route3 0.3: v27.37,23.32 27.37,20.82 v28.12,20.07 | 28.12,20.95 28.12,20.82 | 28.12,20.82 v28.12,20.07 | 28.12,20.82 29.24,21.95 v29.24,22.01 | v57.87,26.32 57.87,19.32 58.87,18.32 v63.37,18.32 66.37,18.32 v67.37,19.32 69.37,21.32 v69.37,26.82 | v49.87,19.32 46.37,15.82 42.87,15.82 v35.87,15.82 | v28.12,20.07 28.37,19.82 29.87,19.82 30.37,19.32 v30.37,16.95
  Bottom 0.2: IMU.2 84.95,47.24 85.37,46.82 85.37,43.32 84.37,42.32 78.37,42.32
  Bottom 0.3: 78.37,42.32 v69.37,33.32 | v35.87,15.82 34.74,16.95 v30.37,16.95 29.97,16.55 29.97,13.38 29.62,13.03 27.21,13.03 24.99,10.82 v22.68,10.82
5V  (via drill 0.35)
  Top 0.3: 67.01,6.82 U1.4 65.71,6.91 v65.56,6.76 | U9.19 64.04,17 v64.37,17.32 | IC3.3 79.35,54.3 80.33,53.32 v80.37,53.32 | R3.2 59.76,1.32 v60.87,1.32 61.92,1.32 R1.1 | v69.12,2.82 v69.11,2.82 U2.16 | U1.6 65.68,8.51 v65.56,8.38 | U1.18 57.44,9.31 57.31,9.45 57.31,10.38 56.53,11.16 C60.1 56.41,11.32 v57.37,11.32 | U$8.3 57.37,23.72 C3.1 58.59,22.17 v58.74,22.32 | v84.06,68.19 84.06,68.84 U10.1 | v31.87,15.51 32.06,15.7 U$11.4 U$11.3 | U$10.4 U$10.3 32.62,10.76 32.68,10.7 32.68,9.88 32.12,9.32 v31.87,9.32 32.06,9.32 | C2.1 56.71,6.98 v56.87,6.82
  Route3 0.3: 67.87,17.32 v64.37,17.32 63.97,16.92 63.12,16.92 62.92,16.72 62.12,16.72 62.02,16.82 v61.37,16.82 | 67.87,17.32 76.37,17.32 78.12,19.07 | v60.87,1.32 64.37,1.32 64.37,1.29 65.02,0.64 67.19,0.64 69.12,2.57 v69.12,2.82 67.87,4.07 67.87,6.76 | 67.87,8.32 67.87,6.76 | 67.87,8.32 67.87,17.32 | v65.56,6.76 67.87,6.76 | v65.56,8.38 65.62,8.32 67.87,8.32 | ENCODER.1 7.28,56.23 8.87,57.82 8.87,63.32 10.87,65.32 74.37,65.32 75.37,64.32 | 78.12,19.07 80.42,21.37 80.42,49.55 80.37,49.6 v80.37,53.32 78.37,55.32 75.87,55.32 75.37,55.82 75.37,64.32 | 78.12,19.07 80.34,16.85 THR.2 SER.2 1.2 2.2 3.2 | 75.37,64.32 80.18,64.32 v84.06,68.19
  Bottom 0.3: v31.87,15.51 31.87,11.38 32.43,10.82 | v58.74,22.32 58.74,19.45 v61.37,16.82 57.37,12.82 v57.37,11.32 56.87,10.82 | 32.49,9.95 32.37,9.82 | 32.37,9.82 v31.87,9.32 | 56.87,10.82 32.43,10.82 | 32.37,9.82 32.37,10.76 32.43,10.82 | v56.87,6.82 56.87,10.82
ACHANNEL_5V
  Top 0.3: ENCODER.2 5.32,58.77 5.87,59.32 5.87,69.82 7.37,71.32 15.37,71.32 16.19,70.5 X1.35
BCHANNEL_5V
  Top 0.3: ENCODER.4 3.02,70.47 4.37,71.82 17.87,71.82 18.73,70.96 X1.33
DIO0_3V3
  Top 0.3: U8.10 73.82,27.02 74.12,27.32 74.12,37.32 77.2,40.4 U3.9
DN1_VBUS  (via drill 0.35)
  Top 0.3: FB1.1 6.93,27.95 v7.06,27.82 | C24.+ 36.64,24.59 C27.1 | v30.93,21.26 31.12,21.07 31.32,21.07 31.56,20.83 U$11.10
  Route3 0.3: v7.06,27.82 24.87,27.82 24.87,27.32 29.67,22.52 | 29.67,22.52 v30.93,21.26 | C24.+ 29.67,22.52
DN2_VBUS  (via drill 0.35)
  Top 0.3: FB2.1 7.89,9.84 v8.37,10.32 | C26.1 37.03,12.2 C25.+ | 32.01,21.43 v31.87,21.57 32.06,21.38 U$11.9
  Route3 0.3: 33.87,13.72 33.72,13.72 32.91,12.92 26.47,12.92 22.37,8.82 16.37,8.82 14.87,10.32 v8.37,10.32 | 33.87,13.72 C25.+ | v31.87,21.57 33.12,21.57 33.87,20.82 33.87,13.72
DN3_VBUS  (via drill 0.35)
  Top 0.3: FB3.1 14.57,6.82 v15.87,6.82 | C23.1 41.9,5.07 C20.+ | U$10.10 27.31,10.76 v26.99,11.07
  Route3 0.3: v15.87,6.82 17.37,8.32 23.87,8.32 | 23.87,8.32 25.62,8.32 26.99,9.7 v26.99,11.07 | C20.+ 35.29,5.38 34.48,6.2 25.99,6.2 23.87,8.32
DN4_VBUS  (via drill 0.35)
  Top 0.3: FB4.1 31.74,7.19 v31.87,7.32 | v26.87,11.82 27.22,11.82 27.43,11.61 27.43,11.49 27.67,11.26 U$10.9 | C22.1 49.44,1.68 C21.+
  Route3 0.3: C21.+ 47.24,2.95 43.37,6.82 32.37,6.82 v31.87,7.32 31.87,8.45 30.99,9.32 28.87,9.32 28.37,9.82 28.37,10.67 27.37,11.67 27.02,11.67 v26.87,11.82
ESTOP_3V3  (via drill 0.35)
  Top 0.3: U8.3 71.28,20.91 70.87,21.32 v65.37,21.32 | v62.68,21.32 62.37,21.32 62.09,21.05 U9.5
  Bottom 0.3: v65.37,21.32 v62.68,21.32
ESTOP_5V  (via drill 0.35)
  Top 0.3: U9.16 62.09,17.05 v62.37,17.32 | v64.24,57.7 v69.37,57.7 | v84.56,64.13 84.18,64.51 R28.1
  Bottom 0.3: v62.37,17.32 63.37,17.32 66.37,20.32 66.37,44.82 62.87,48.32 62.87,56.32 v64.24,57.7 | v69.37,57.7 74.74,57.7 76.68,59.63 84.49,59.63 84.93,60.07 84.93,63.76 v84.56,64.13
GND  (via drill 0.35)
  Top 0.2: D1.C 55.87,5.24 C2.2
  Top 0.3: R7.1 7.24,45.95 v6.37,46.82 | C10.2 6.56,35.63 v6.37,35.82 | C13.2 7.5,15.19 v8.37,14.32 | C16.2 9.55,7.75 v9.87,8.07 | C19.2 24.01,7.18 v23.87,7.32 | C26.2 34.51,9.46 v34.37,9.32 | C23.2 40.2,2.65 v40.37,2.82 | C22.2 44.35,2.8 v44.37,2.82 | C27.2 33.9,26.29 v34.37,25.82 | S1.3 82.88,16.08 THR.1 | C60.2 54.55,9.25 C59.2 54.7,6.49 v54.87,6.32 55.83,5.36 C2.2 | v22.87,22.82 23.49,23.44 R25.1 23.87,24.9 v23.87,25.82 24.07,26.02 C4.2 | U3.3 71.2,31.65 v71.37,31.82 | v9.37,51.82 9.37,50.36 C7.2 | U2.8 73.66,12.62 v73.37,12.32 | U1.21 59.78,6.91 v59.87,6.82 | U3.14 67.2,41.99 v67.37,41.82 | U3.13 69.2,41.99 v69.37,41.82 | v63.87,53.32 65.37,53.32 | v63.87,52.32 65.37,52.32 | v63.87,50.32 65.37,50.32 | v63.87,49.32 65.37,49.32 | U8.14 67.78,24.73 v67.37,24.32 | U9.11 58.84,15.8 v59.37,16.32 | R17.1 27.34,15.1 v26.87,15.57 | U$1.P$1 v17.62,17.07 | 69.37,51.82 69.74,51.82 IC3.TAB 69.36,51.32 v63.87,51.32 | U1.3 65.66,6.11 v65.56,6.01 | U1.5 65.7,7.71 v65.56,7.57 | R20.1 28.94,23.23 28.58,22.86 | 28.58,22.92 28.58,22.86 | 28.58,22.86 28.58,22.53 v28.37,22.32 | C38.2 17.39,26.34 v16.87,25.82 | C30.2 6.43,26.25 v5.99,25.82 | C29.2 6.51,22.79 U$3.GND | C46.2 42.52,20.47 v42.37,20.32 | C45.2 45.02,20.47 v44.87,20.32 | C44.2 47.52,20.47 v47.37,20.32 | U$8.1 53.87,24.82 v53.37,25.32 | U4.2 49.23,25.18 v48.87,24.82 | C47.2 53.52,20.47 v53.37,20.32 | C3.2 56.02,20.47 v55.87,20.32 | C48.2 53.87,18.32 v53.37,18.82 | C49.2 66.22,15.47 v65.99,15.7 | v10.87,24.07 10.8,24 C43.2 | U10.3 82.88,71.32 v82.37,71.32 | R2.2 79.74,68.13 v80.12,68.51 | U$11.2 31.06,18.7 v31.24,18.88 | U$10.2 30.74,10.26 v30.49,10.51
  Bottom 0.3: C8.2 3.14,28.66 C9.2 3.29,26.43 R10.1 3.23,24.96 4.01,24.18 U$3.GND | C11.2 3.05,11.3 C12.2 3.09,9 R9.1 3.04,7.65 3.66,7.03 U$4.GND | C14.2 12.91,3.32 C15.2 15.16,3.34 R11.1 16.47,3.42 16.92,3.87 U$5.GND | C17.2 30.46,2.99 C18.2 32.79,3.04 R12.1 34.07,4.26 U$6.GND | C5.2 3.24,45.61 C6.2 3.14,43.27 R8.1 3.21,41.98 3.87,41.32 U$7.GND | C35.2 16.38,18.31 v16.62,18.07 | v17.62,18.07 18.16,18.61 C28.2 18.28,19.3 18.92,19.94 C36.2 | v18.62,16.07 19.49,15.2 R4.1 21.46,13.71 C37.2 C42.2 | C31.2 18.92,14.77 v17.62,16.07 | C41.2 14.89,12.02 C32.2 16.38,15.83 v16.62,16.07 15.11,14.56 C33.2 | 16.59,17.1 v16.62,17.07 16.27,16.73 C34.2 | v28.37,22.32 27.87,22.32 27.37,21.82 27.37,19.83 R24.1 30.76,19.37 v31.24,18.88 | 80.87,46.86 C1.2 | 80.87,46.86 81.36,46.86 IMU.1 | C61.2 79.1,45.09 80.87,46.86 | 21.46,20.99 C39.2 | Y1.2 60.49,8.94 v60.37,8.82 | v18.62,18.07 19.45,17.23 R5.1 21.27,18.53 21.27,19.07 21.46,19.26 C39.2 | C40.2 12.09,18.95 R23.1 10.87,22.13 v10.87,24.07 | C39.2 21.46,21.41 v22.87,22.82
  Bottom 0.6: CR1.2 73.37,56.82 75.87,56.82 76.44,57.39 X4.GND
  other vias: 18.62,17.07 29.62,12.07 30.49,12.07 29.62,10.51 32.81,18.88 32.81,18.01 30.06,11.26 32.06,18.45 31.24,18.01
  pour Route2: -0.13,0.59 86.23,0.59 86.23,72.98 -0.13,72.98
I2C0_SCL
  Bottom 0.3: IMU.4 83.02,51.82 69.37,51.82 67.87,53.32 67.87,60.82 62.62,66.07 45.62,66.07 45.37,66.32 45.37,68.69 X1.13
I2C0_SDA
  Bottom 0.3: IMU.3 82.98,50.32 68.87,50.32 66.87,52.32 66.87,58.82 61.87,63.82 61.87,64.32 61.37,64.82 43.87,64.82 42.87,65.82 42.87,70.82 43.37,71.32 45.37,71.32 45.87,70.82 45.87,70.73 X1.11
MISO_3V3
  Top 0.3: U8.8 76.36,25.81 78.12,27.57 78.12,43.1 U3.8
MISO_5V
  Top 0.3: U9.13 60.14,12.46 60.05,12.36 60.05,11.82 U1.16
MISO_JOULE  (via drill 0.35)
  Top 0.3: U9.8 60.14,22.09 v60.37,22.32
  Bottom 0.3: v60.37,22.32 52.55,30.13 23.37,30.13 22.56,30.95 22.56,33.18 X2.29
MODE_SELECT_3V3
  Top 0.3: U8.11 72.55,23 71.87,22.32 65.37,22.32 64.69,21.64 U9.1
MODE_SELECT_5V
  Top 0.3: 74.71,3.74 U2.1 71.46,3.73 70.53,4.66 70.53,14.27 U9.20
MOSI_3V3  (via drill 0.35)
  Top 0.3: U8.7 76.36,20.83 v75.87,21.32 | v74.37,21.32 74.49,21.44 74.49,26.58 75.2,27.29 U3.5
  Bottom 0.3: v75.87,21.32 v74.37,21.32
MOSI_5V
  Top 0.3: U9.14 60.79,11.77 U1.15
MOSI_JOULE
  Top 0.3: U9.7 60.87,19.98 60.87,21.32 61.37,21.82 61.37,28.32 59.87,29.82 28.31,29.82 27.62,30.51 27.62,33.16 X2.27
N$1
  Top 0.3: U3.1 67.23,29.18 67.37,29.32 63.87,29.32 63.87,27.55 JP6.1
N$2
  Top 0.3: U2.4 76.4,7.54 76.87,7.07 78.37,7.07 79.12,7.82 79.12,10.57 78.87,10.82 SER.3
N$3
  Top 0.3: THR.3 77.8,13.25 75.87,11.32 74.73,11.32 U2.7
N$4  (via drill 0.35)
  Top 0.3: U1.29 63.03,1.38 R1.2 65.37,1.38 v65.37,1.32 | v77.87,16.32 78.75,16.32 S1.1
  Bottom 0.3: v77.87,16.32 77.87,15.32 79,14.19 79,2.41 77.91,1.32 v65.37,1.32
N$5
  Top 1: X5.GND 78.72,62.24 Q1.DRAIN
N$6  (via drill 0.35)
  Top 0.3: U1.7 64.37,9.31 v64.37,8.57
  Bottom 0.3: Y1.1 64.37,7.74 v64.37,8.57
N$7
  Top 0.3: R28.2 84.87,67.86 84.87,69.32 84.49,69.69 U10.2
N$8  (via drill 0.35)
  Top 0.3: U1.8 65.37,10.11 v65.37,10.07
  Bottom 0.3: Y1.3 65.37,10.14 v65.37,10.07
N$9  (via drill 0.35)
  Top 0.3: U$1.8 24.84,16.85 v25.37,16.32
  Bottom 0.3: v25.37,16.32 22.8,16.32 R4.2
N$10
  Top 0.3: U2.3 77.27,6.27 2.3
N$11
  Top 0.3: U2.6 76,10.08 1.3
N$12
  Top 0.3: U8.4 72.55,16.74 R43.1
N$13
  Top 0.3: C59.1 56.4,8.79 57.37,7.82 58.23,7.82 U1.20
N$14  (via drill 0.35)
  Top 0.3: U$1.10 24.84,17.85 v25.37,17.32
  Bottom 0.3: R5.2 25.28,17.23 v25.37,17.32
N$15  (via drill 0.35)
  Top 0.3: R6.2 9.31,48.01 R7.2 9.31,31.38 10.87,29.82 24.37,29.82 v24.87,29.32 | U$1.16 24.4,20.85 24.87,21.32 v24.87,25.82
  Bottom 0.3: v24.87,29.32 v24.87,25.82
N$16
  Top 0.3: U$7.VBUS 5.4,48.04 R6.1 7.74,48.14 C7.1
N$17
  Top 0.3: U$4.VBUS 6.52,14.03 C13.1 7.06,11.61 FB2.2
N$18
  Bottom 0.3: U$7.SHLD2 1.54,50.52 C5.1 1.44,47.66 C6.1 1.51,45.44 R8.2 1.51,39.15 U$7.SHLD1
N$19
  Top 0.3: U$7.DM 3.67,44.37 3.67,40.63 7.92,36.38 7.92,28.88 9.23,27.57 18.37,27.57 18.9,27.04 U$1.22
N$20
  Top 0.2: R3.1 56.43,1.38 D1.A
N$21
  Top 0.3: U$7.DP 4.37,43.82 4.12,43.57 4.12,40.82 8.37,36.57 8.37,29.07 9.37,28.07 10.12,28.07 10.37,28.32 10.37,28.82 10.62,29.07 10.87,29.07 11.12,28.82 11.12,28.32 11.37,28.07 18.87,28.07 19.4,27.54 U$1.21
N$22
  Top 0.3: U$5.VBUS 11.25,6.53 C16.1 FB3.2
N$23
  Top 0.3: U$3.VBUS 5.4,30.89 FB1.2 6.93,32.32 C10.1 6.74,32.51
N$24
  Top 0.3: U$6.VBUS 27.2,5.33 C19.1 FB4.2
N$25
  Top 0.3: R20.2 31.96,23.23 32.37,22.82 | 32.51,22.68 32.37,22.82 | 32.37,22.82 33.06,22.13 U$11.8
N$26  (via drill 0.35)
  Top 0.3: U$1.18 20.9,21.6 v20.12,20.82
  Bottom 0.3: C28.1 20.12,19.57 v20.12,20.82
N$27  (via drill 0.35)
  Top 0.3: U$1.32 13.9,22.35 v13.43,21.88
  Bottom 0.3: v13.43,21.88 13.79,21.52 R23.2
N$28
  Top 0.3: R17.2 27.37,12.92 27.37,12.32 27.43,12.26 U$10.8
N$29
  Top 0.3: U$1.30 14.9,24.73 R26.1 14.53,25.27 10.01,25.27 Y2.1 9.1,23.04 C29.1
N$30
  Top 0.3: U$1.29 15.4,23.57 16.09,24.26 16.09,25.42 R26.2 13.19,26.52 13.05,26.66 Y2.3 11.09,26.66 10.17,25.75 8.22,25.75 C30.1
N$31
  Top 0.3: R25.2 21.79,23.19 U$1.17
N$32  (via drill 0.35)
  Top 0.3: U$1.2 24.84,13.85 v25.37,13.32 | v10.37,12.82 10.9,13.35 U$1.48 13.4,13.35 v13.62,13.57 | 14.4,21.32 14.4,21.04 v14.87,20.57 | 14.4,21.32 U$1.31 | v19.87,21.57 19.9,21.6 U$1.20 19.9,24.54 v20.18,24.82 | C43.1 12.82,22.45 12.82,21.59 13.14,21.27 14.35,21.27 14.4,21.32 | v26.62,24.57 28.37,26.32 29.87,26.32 30.39,25.8 FB6.1
  Route3 0.3: v25.37,13.32 25.12,13.57 v13.62,13.57 14.87,14.82 v14.87,20.57 15.87,21.57 v19.87,21.57
  Bottom 0.3: 21.47,24.57 21.12,24.92 20.56,24.92 20.46,24.82 v20.18,24.82 | 21.47,24.57 21.47,24.07 21.46,24.06 C39.1 | v25.37,13.32 25.37,12.32 24.87,11.82 24.01,11.82 C42.1 | v10.37,12.82 12.19,12.82 C41.1 | v14.87,20.57 14.87,19.82 14.21,19.16 14,19.16 C40.1 | v26.62,24.57 21.47,24.57
N$33  (via drill 0.35)
  Top 0.3: U$1.13 22.4,19.35 v21.87,18.82
  Bottom 0.3: v21.87,18.82 24.66,18.82 R24.2
N$34  (via drill 0.35)
  Top 0.3: U$1.37 10.9,18.85 v10.37,18.32 | U$1.19 20.4,23.79 20.81,24.2 v20.81,24.26 | U$1.63 20.9,10.35 v20.37,9.82 | U$1.60 19.4,10.35 v18.87,9.82 | U$1.53 15.9,10.29 v16.37,9.82 | U$1.45 10.9,14.85 v10.37,14.32 | U$1.25 17.4,23.79 v16.87,24.32 17.19,24.64 C38.1 | FB5.1 20.51,25.46 20.81,25.16 v20.81,24.26 | v20.81,24.26 20.81,24.54
  Route3 0.3: v20.81,24.26 20.37,23.82 17.37,23.82 v16.87,24.32 16.87,23.82 11.37,18.32 v10.37,18.32 v10.37,14.32 11.87,14.32 v16.37,9.82 v18.87,9.82 v20.37,9.82
  Bottom 0.3: v20.37,9.82 20.37,10.71 C37.1 | v18.87,9.82 18.87,11.76 C31.1 | v16.37,9.82 16.37,11.79 C32.1 | v10.37,14.32 10.61,14.56 C33.1 | v16.87,24.32 16.38,23.83 C35.1 | 11.59,17.1 11.37,17.32 | 11.37,17.32 v10.37,18.32 | v20.81,24.26 19.44,22.89 C36.1 | 11.37,17.32 11.96,16.73 C34.1
N$35
  Bottom 0.3: U$6.SHLD2 25.2,1.29 C17.1 28.22,1.34 C18.1 30.54,1.31 R12.2 35.95,1.31 U$6.SHLD1
N$36
  Bottom 0.3: U$5.SHLD2 7.73,1.62 C14.1 10.69,1.64 C15.1 13.01,1.72 R11.2 19.22,1.72 U$5.SHLD1
N$37
  Bottom 0.3: U$3.SHLD2 1.44,33.27 C8.1 1.44,28.66 C9.1 1.59,26.43 R10.2 1.53,21.98 U$3.SHLD1
N$38
  Bottom 0.3: U$4.SHLD2 2.41,17.1 1.35,16.04 C11.1 1.39,13.4 C12.1 1.34,11.21 R9.2 1.34,5.03 2.41,3.96 U$4.SHLD1
N$40
  Top 0.3: U4.8 45.77,23.91 46.37,23.32 C45.1
N$41
  Top 0.3: U9.10 58.84,18.8 58.37,18.32 C48.1 R27.1
N$42
  Top 0.3: R29.1 81.93,68.72 U10.6 82.84,69.04 83.06,69.26 83.06,70.13 82.84,70.34 U10.4
N$43
  Top 1: 69.87,70.06 Q1.P8 66.49,68.5 J1.1 | Q1.P7 69.87,70.06 | 71.37,70.06 69.87,70.06 | 73.37,70.06 71.37,70.06 | 73.37,70.06 Q1.P2 | Q1.P6 71.37,70.06 | Q1.P5 73.37,70.06 | Q1.P3 73.37,70.06 | Q1.P4 73.37,70.06
N$45
  Top 0.3: Q1.GATE 77.87,68.64 77.87,66.32 78.73,65.46 R2.1 79.75,65.47 R29.2
NSS_3V3
  Top 0.3: U8.6 75.09,21.54 75.87,22.32 77.37,22.32 79.2,24.15 79.2,26.32 U3.7
OVERCUR1Z
  Top 0.3: U$1.14 26.92,19.85 R21.1 29.04,20.27 30.51,20.27 30.59,20.34 U$11.11
OVERCUR2Z
  Top 0.3: U$1.15 25.4,20.35 26.24,21.19 R22.1 | R22.1 26.66,21.71 | R22.1 26.61,21.71 27.97,23.07 27.97,23.08 29.02,24.13 32.12,24.13 32.9,23.35 | 33.01,23.23 32.9,23.35 | 32.9,23.35 33.87,22.38 33.87,19.82 33.62,19.57 32.87,19.57 32.82,19.62 32.79,19.62 32.56,19.86 U$11.7
OVERCUR3Z  (via drill 0.35)
  Top 0.3: U$1.12 25.66,18.85 26.39,18.12 28.25,18.12 29.07,17.3 R18.1 28.15,16.32 v27.87,16.32 | v26.24,16.32 26.24,10.95 26.93,10.26 U$10.11
  Bottom 0.3: v27.87,16.32 v26.24,16.32
OVERCUR4Z
  Top 0.3: U$1.11 25.53,18.35 26.21,17.67 26.62,17.67 R19.1 27.27,17.02 27.27,16.07 27.64,15.7 28.01,15.7 28.27,15.44 28.27,13.82 28.88,13.21 28.88,11.99 28.65,11.76 U$10.7
PC_PWM_SERVO  (via drill 0.35)
  Top 0.3: U1.9 66.87,11.6 v66.87,11.82 | U2.2 72.19,5 71.37,5.82 v71.37,10.82
  Bottom 0.3: v66.87,11.82 71.37,11.82 v71.37,10.82
PC_PWM_THROTTLE  (via drill 0.35)
  Top 0.3: U2.5 72.37,8.8 v72.37,12.82 | 65.87,13.18 v65.87,13.32 65.37,12.82 64.87,12.82 64.63,12.58 U1.10
  Bottom 0.3: v72.37,12.82 72.37,13.82 65.87,13.82 v65.87,13.32
PWRCTL1  (via drill 0.35)
  Top 0.3: U$1.4 24.9,14.85 v25.37,15.32 | 30.87,14.32 31.62,14.32 32.56,15.26 U$11.5 | 30.87,14.32 v28.99,14.32 | R13.1 30.78,14.41 30.87,14.32
  Bottom 0.3: v25.37,15.32 26.37,14.32 v28.99,14.32
PWRCTL2  (via drill 0.35)
  Top 0.3: U$1.3 25.34,14.35 v25.37,14.32 | v29.37,13.63 31.82,13.63 32.94,14.75 | 32.94,14.75 33.06,14.87 U$11.6 | 32.94,14.75 34.8,14.75 35.07,15.02 R14.1
  Bottom 0.3: v25.37,14.32 26.06,13.63 v29.37,13.63
PWRCTL3
  Top 0.3: U$1.1 24.34,13.35 25.37,12.32 25.37,9.32 | R15.1 25.17,9.52 25.37,9.32 | 25.99,8.63 25.84,8.79 | 25.84,8.79 25.37,9.26 25.37,9.32 | U$10.5 32.74,11.76 33.24,11.26 33.24,9.76 31.99,8.51 26.12,8.51 25.84,8.79
PWRCTL4
  Top 0.3: 33.69,9.51 32.19,8.01 25.68,8.01 25.37,8.32 21.81,8.32 21.4,8.73 U$1.64 | 33.69,9.51 33.69,7.9 R16.1 | 33.69,9.51 33.69,11.57 33,12.26 U$10.6
RC_CH3_3V3
  Top 0.3: U8.12 71.28,23.23 70.87,22.82 64.37,22.82 63.39,21.84 U9.3
RC_CH3_5V  (via drill 0.35)
  Top 0.3: U9.18 63.37,14.27 v63.37,16.32
  Bottom 0.3: 3.3 77.8,3.32 75.87,3.32 75.87,13.32 72.87,16.32 v63.37,16.32
SCK_3V3
  Top 0.3: U8.9 75.09,26.54 75.37,26.82 76.37,26.82 77.2,27.65 U3.6
SCK_5V
  Top 0.3: U9.12 59.49,13.2 58.87,12.57 58.87,10.64 U1.17
SCK_JOULE
  Top 0.3: U9.9 59.37,20.03 59.37,26.82 56.87,29.32 26.68,29.32 25.12,30.88 25.12,35.38 25.68,35.95 27.62,35.95 28.89,34.67 X2.25
USB_DM_DN1
  Top 0.3: U$3.DM 3.42,26.98 3.42,23.38 6.45,20.35 U$1.34
USB_DM_DN2
  Top 0.3: U$4.DM 4.41,11.53 4.12,11.82 4.12,14.57 5.95,16.4 8.04,16.4 8.37,16.07 8.37,15.57 8.62,15.32 8.87,15.32 9.12,15.57 9.12,16.07 9.37,16.32 9.62,16.32 9.87,16.07 9.87,15.57 10.12,15.32 10.37,15.32 10.62,15.57 10.62,16.07 10.9,16.35 U$1.42
USB_DM_DN3
  Top 0.3: U$5.DM 12.42,4.38 11.87,3.82 9.87,3.82 8.37,5.32 8.37,8.32 8.87,8.82 12.37,8.82 13.37,7.82 15.37,7.82 15.62,8.07 15.62,8.32 15.37,8.57 14.62,8.57 14.37,8.82 14.37,9.07 14.62,9.32 15.37,9.32 15.62,9.57 15.62,9.82 15.37,10.07 14.62,10.07 14.4,10.29 U$1.50
USB_DM_DN4
  Top 0.3: U$6.DM 29.57,4.27 29.12,3.82 26.87,3.82 24.12,6.57 22.62,6.57 22.37,6.82 22.37,7.32 22.12,7.57 21.87,7.57 21.62,7.32 21.62,6.82 21.37,6.57 21.12,6.57 20.87,6.82 20.87,7.32 20.62,7.57 20.37,7.57 20.12,7.32 20.12,6.82 19.87,6.57 19.12,6.57 17.9,7.79 U$1.57
USB_DP_DN1
  Top 0.3: U$3.DP 4.22,26.68 3.87,26.32 3.87,23.57 6.62,20.82 8.12,20.82 8.37,21.07 8.37,21.57 8.62,21.82 8.87,21.82 9.12,21.57 9.12,21.07 9.37,20.82 9.62,20.82 9.87,21.07 9.87,21.57 10.12,21.82 10.37,21.82 10.62,21.57 10.62,21.07 10.84,20.85 U$1.33
USB_DP_DN2
  Top 0.3: U$4.DP 4.41,9.53 3.62,10.32 3.62,14.71 5.76,16.85 U$1.41
USB_DP_DN3
  Top 0.3: U$1.49 13.9,9.49 13.73,9.32 8.23,9.32 7.92,9.01 7.92,5.13 9.68,3.37 13.92,3.37 14.42,3.87 U$5.DP
USB_DP_DN4
  Top 0.3: U$6.DP 31.57,4.02 30.92,3.37 26.68,3.37 23.93,6.12 18.93,6.12 17.4,7.65 U$1.56
V1P8V
  Route3 0.406: X2.10 X2.12
V3P3V
  Route3 0.406: X2.6 X2.8
V5P0V
  Route3 0.406: X2.2 X2.4
VCC  (via drill 0.35)
  Top 0.3: X4.V+ 82.64,54.64 81.24,53.24 81.24,50.76 v79.81,49.32 79.71,49.22 IC3.1
  Route3 0.3: X4.V+ X5.V+
  Bottom 0.3: C61.1 77.4,46.74 C1.1 77.52,47.97 77.62,48.07 79.56,48.07 79.81,48.32 v79.81,49.32
  Bottom 0.6: X4.V+ 80.93,55.68 80.93,55.55 80.2,54.82 CR1.1

### Text on the board
Document: S | + | -